# Altium project Linux-Capable-Business-Card.PrjPcb
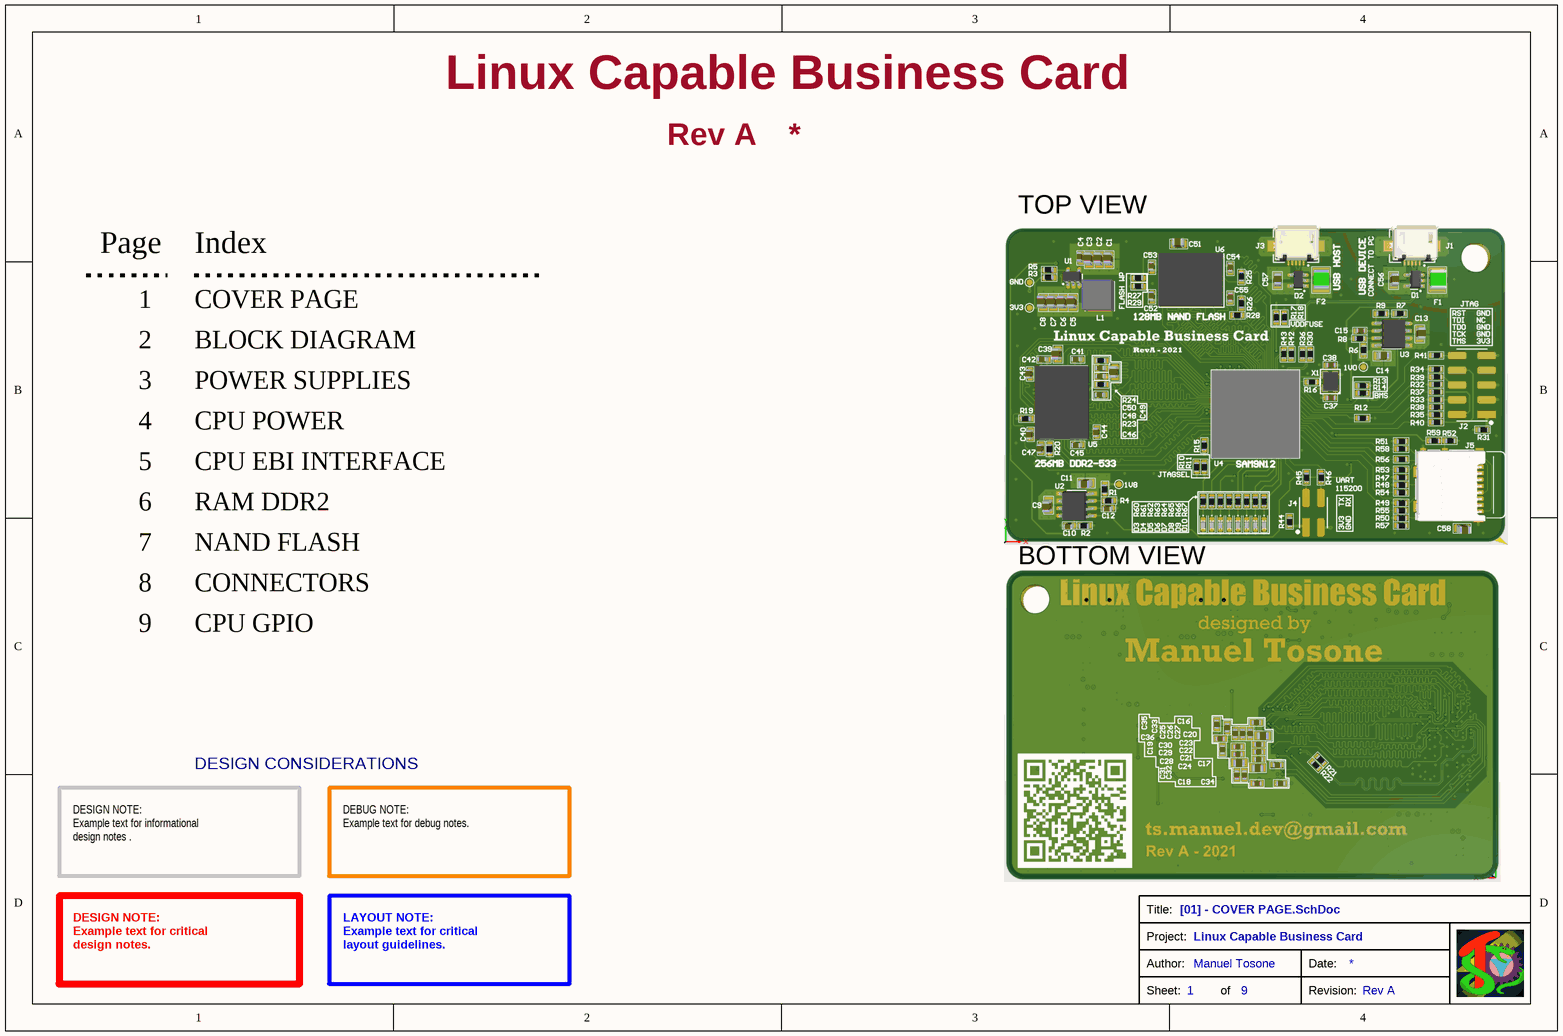
[diagram p0: [01] - COVER PAGE.SchDoc]
AuthorName: Manuel Tosone; ProjectRevision: Rev A; ProjectTitle: Linux Capable Business Card
9 sheets, 154 parts. Net scope: flat (ports and power ports of the same name join across sheets).
Board file: Linux-Capable-Businnes-Card.PcbDoc
Sheets:
  [01] - COVER PAGE.SchDoc
  [02] - BLOCK DIAGRAM.SchDoc
  [03] - POWER SUPPLIES.SchDoc
  [04] - CPU POWER.SchDoc
  [05] - CPU EBI INTERFACE.SchDoc
  [06] - RAM DDR2.SchDoc
  [07] - NAND FLASH.SchDoc
  [08] - CONNECTORS.SchDoc
  [09] - CPU GPIO.SchDoc

## Sheet [01] - COVER PAGE.SchDoc
size A4; DocumentNumber: 1; SheetNumber: 1; SheetTotal: 9

### Notes on the sheet
- TOP VIEW
- Page
- 1
- Index
- COVER PAGE
- 2
- BLOCK DIAGRAM
- 3
- 4
- POWER SUPPLIES
- CPU POWER
- 5
- 6
- CPU EBI INTERFACE
- RAM DDR2
- 7
- NAND FLASH
- BOTTOM VIEW
- 8
- 9
- CONNECTORS
- CPU GPIO
- DESIGN CONSIDERATIONS
- DESIGN NOTE:
  Example text for informational
  design notes .
- DEBUG NOTE:
  Example text for debug notes.
- DESIGN NOTE:
  Example text for critical
  design notes.
- LAYOUT NOTE:
  Example text for critical
  layout guidelines.
- Title:
- Project:
- Sheet:
- Author:
- of
- Revision:
- Date:

## Sheet [02] - BLOCK DIAGRAM.SchDoc
size A4; DocumentNumber: 2; SheetNumber: 2; SheetTotal: 9
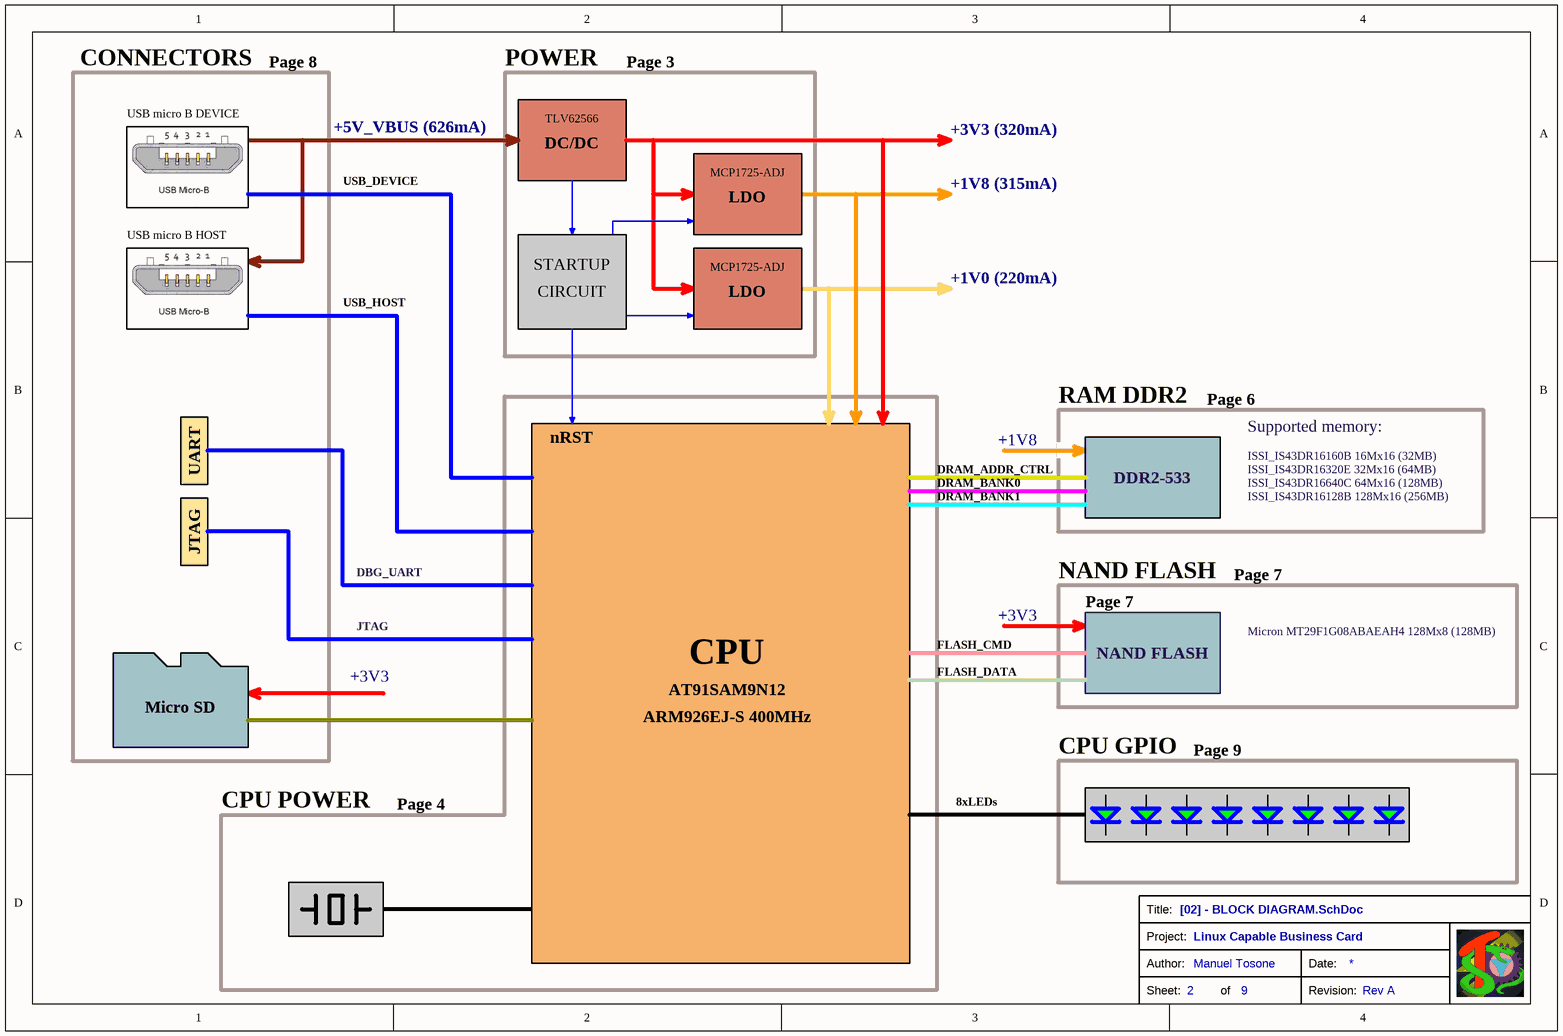
[diagram p1: [02] - BLOCK DIAGRAM.SchDoc]

### Notes on the sheet
- CONNECTORS
- USB micro B DEVICE
- Page 8
- POWER
- Page 3
- USB_DEVICE
- +5V_VBUS (626mA)
- TLV62566
- DC/DC
- MCP1725-ADJ
- +3V3 (320mA)
- USB micro B HOST
- LDO
- +1V8 (315mA)
- USB_HOST
- STARTUP
- CIRCUIT
- +1V0 (220mA)
- UART
- nRST
- +1V8
- PMIC 1
- RAM DDR2
- Page 6
- Supported memory:
- DRAM_ADDR_CTRL
- DRAM_BANK0
- DRAM_BANK1
- DDR2-533
- ISSI_IS43DR16160B 16Mx16 (32MB)
- ISSI_IS43DR16320E 32Mx16 (64MB)
- ISSI_IS43DR16640C 64Mx16 (128MB)
- ISSI_IS43DR16128B 128Mx16 (256MB)
- JTAG
- DBG_UART
- NAND FLASH
- Page 7
- FLASH_CMD
- +3V3
- Micron MT29F1G08ABAEAH4 128Mx8 (128MB)
- Micro SD
- AT91SAM9N12
- CPU
- FLASH_DATA
- ARM926EJ-S 400MHz
- CPU GPIO
- Page 9
- CPU POWER
- Page 4
- 8xLEDs
- Title:
- Project:
- Sheet:
- Author:
- of
- Revision:
- Date:

## Sheet [03] - POWER SUPPLIES.SchDoc
size A4; DocumentNumber: 3; SheetNumber: 3; SheetTotal: 9
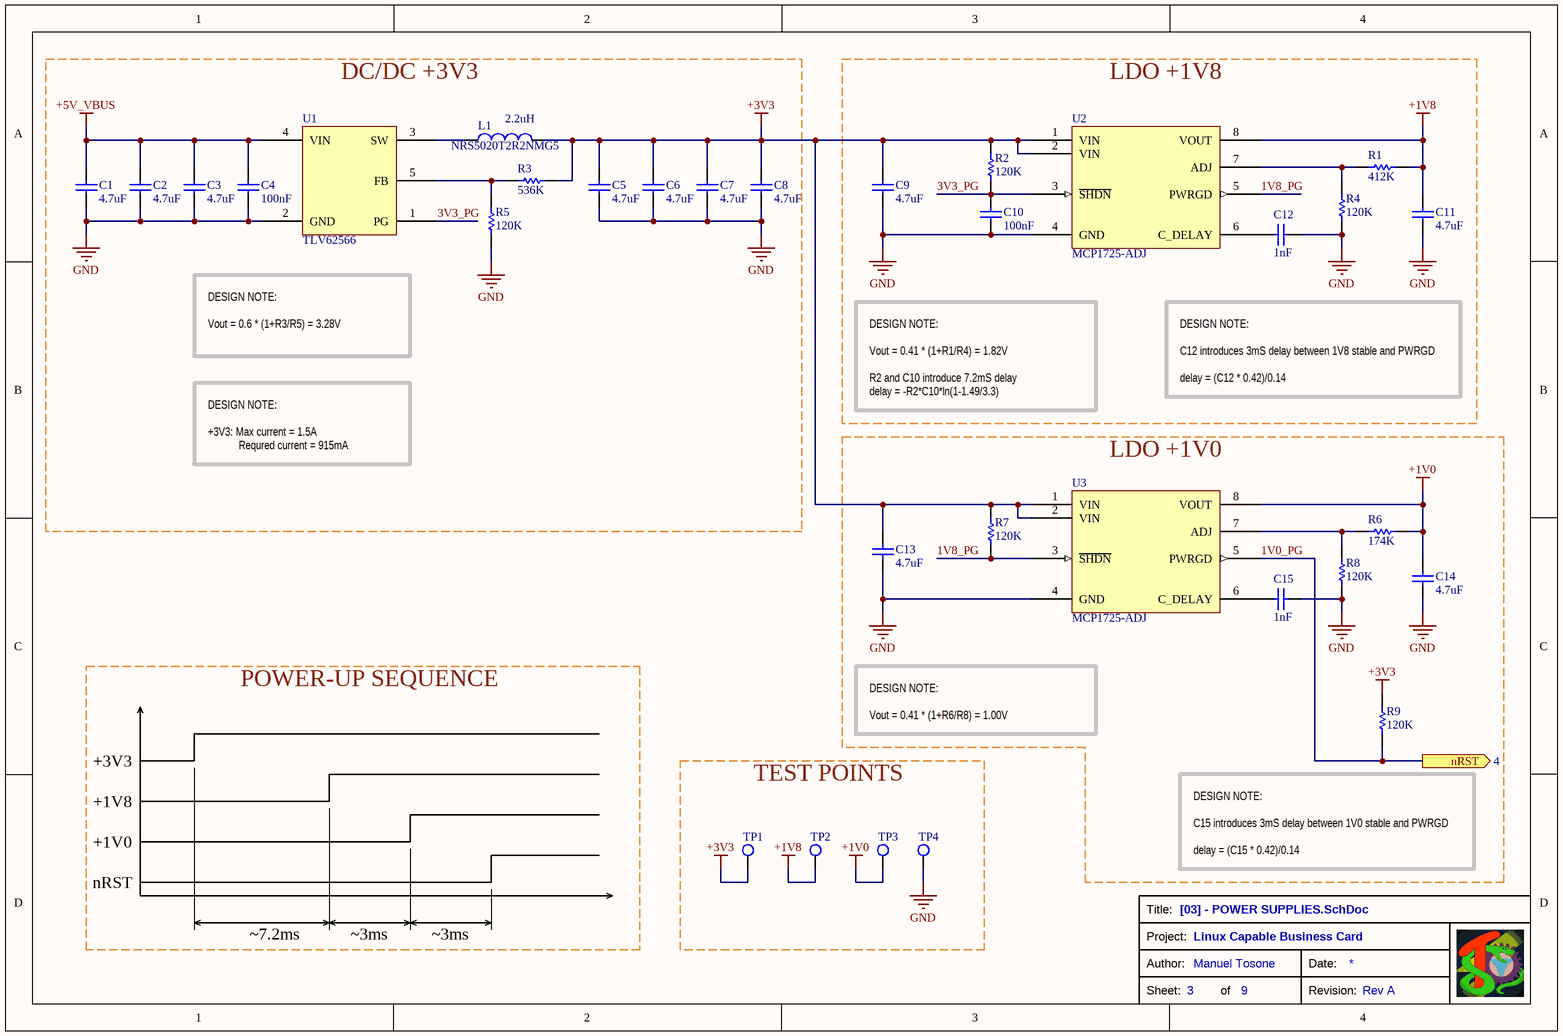
[diagram p2: [03] - POWER SUPPLIES.SchDoc]

### Parts
C1  value 4.7uF  [CAP-0805]  (hidden comment: 885012107013)
C2  value 4.7uF  [CAP-0805]  (hidden comment: 885012107013)
C3  value 4.7uF  [CAP-0805]  (hidden comment: 885012107013)
C4  value 100nF  [CAP-0603]  (hidden comment: C0603C104M4RAC)
C5  value 4.7uF  [CAP-0805]  (hidden comment: 885012107013)
C6  value 4.7uF  [CAP-0805]  (hidden comment: 885012107013)
C7  value 4.7uF  [CAP-0805]  (hidden comment: 885012107013)
C8  value 4.7uF  [CAP-0805]  (hidden comment: 885012107013)
C9  value 4.7uF  [CAP-0805]  (hidden comment: 885012107013)
C10  value 100nF  [CAP-0603]  (hidden comment: C0603C104M4RAC)
C11  value 4.7uF  [CAP-0805]  (hidden comment: 885012107013)
C12  value 1nF  [CAP-0603]  (hidden comment: C0603C102J5RACTU)
C13  value 4.7uF  [CAP-0805]  (hidden comment: 885012107013)
C14  value 4.7uF  [CAP-0805]  (hidden comment: 885012107013)
C15  value 1nF  [CAP-0603]  (hidden comment: C0603C102J5RACTU)
L1  NRS5020T2R2NMG5  value 2.2uH  [NRS5020-SMT-INDUCTOR]
R1  value 412K  [RES-0603]  (hidden comment: RT0603FRE07412KL)
R2  value 120K  [RES-0603]  (hidden comment: RT0603FRE07120KL)
R3  value 536K  [RES-0603]  (hidden comment: RT0603FRE07536KL)
R4  value 120K  [RES-0603]  (hidden comment: RT0603FRE07120KL)
R5  value 120K  [RES-0603]  (hidden comment: RT0603FRE07120KL)
R6  value 174K  [RES-0603]  (hidden comment: RT0603FRE07174KL)
R7  value 120K  [RES-0603]  (hidden comment: RT0603FRE07120KL)
R8  value 120K  [RES-0603]  (hidden comment: RT0603FRE07120KL)
R9  value 120K  [RES-0603]  (hidden comment: RT0603FRE07120KL)
TP1  Test Point 1mm  [TESTPOINT-1mm]  (value not drawn)  (no BOM)
TP2  Test Point 1mm  [TESTPOINT-1mm]  (value not drawn)  (no BOM)
TP3  Test Point 1mm  [TESTPOINT-1mm]  (value not drawn)  (no BOM)
TP4  Test Point 1mm  [TESTPOINT-1mm]  (value not drawn)  (no BOM)
U1  TLV62566  [SOT23-5]
U2  MCP1725-ADJ  [SOIC-8_3.9X4.9]
U3  MCP1725-ADJ  [SOIC-8_3.9X4.9]

### Blocks framed on the sheet
DC/DC +3V3: C1-C8 L1 R3 R5 U1
LDO +1V8: C9-C12 R1 R2 R4 U2
LDO +1V0: C13-C15 R6-R9 U3
TEST POINTS: TP1-TP4

### Ports
nRST (out, see 4)

### Nets
+1V0: C14.2 R6.2 TP3.1 U3.8(VOUT)
+1V8: C11.2 R1.2 TP2.1 U2.8(VOUT)
+3V3: C5.2 C6.2 C7.2 C8.2 C9.2 C13.2 L1.2 R2.2 R3.1 R7.2 R9.2 TP1.1 U2.1(VIN) U2.2(VIN) U3.1(VIN) U3.2(VIN)
+5V_VBUS: C1.2 C2.2 C3.2 C4.2 U1.4(VIN)
GND: C1.1 C2.1 C3.1 C4.1 C5.1 C6.1 C7.1 C8.1 C9.1 C10.1 C11.1 C12.1 C13.1 C14.1 C15.1 R4.1 R5.1 R8.1 TP4.1 U1.2(GND) U2.4(GND) U3.4(GND)
1V0_PG: R9.1 U3.5(PWRGD) ; port nRST
1V8_PG: R7.1 U2.5(PWRGD) U3.3(~{SHDN})
3V3_PG: C10.2 R2.1 U1.1(PG) U2.3(~{SHDN})
NetC12_2: C12.2 U2.6(C_DELAY)
NetC15_2: C15.2 U3.6(C_DELAY)
NetL1_1: L1.1 U1.3(SW)
NetR1_1: R1.1 R4.2 U2.7(ADJ)
NetR3_2: R3.2 R5.2 U1.5(FB)
NetR6_1: R6.1 R8.2 U3.7(ADJ)

### Notes on the sheet
- DESIGN NOTE:
  Vout = 0.6 * (1+R3/R5) = 3.28V
- DESIGN NOTE:
  C12 introduces 3mS delay between 1V8 stable and PWRGD
  delay = (C12 * 0.42)/0.14
- DESIGN NOTE:
  +3V3: Max current = 1.5A
  Requred current = 915mA
- DESIGN NOTE:
  Vout = 0.41 * (1+R1/R4) = 1.82V
  R2 and C10 introduce 7.2mS delay
  delay = -R2*C10*ln(1-1.49/3.3)
- POWER-UP SEQUENCE
- +3V3
- DESIGN NOTE:
  Vout = 0.41 * (1+R6/R8) = 1.00V
- +1V8
- +1V0
- nRST
- ~7.2ms
- ~3ms
- DESIGN NOTE:
  C15 introduces 3mS delay between 1V0 stable and PWRGD
  delay = (C15 * 0.42)/0.14
- Title:
- Project:
- Sheet:
- Author:
- of
- Revision:
- Date:

### Library data of the parts
C1-C3 C5-C9 C11 C13 C14 = CAP-0805-4.7u-885012107013_2: Multilayer Ceramic Capacitors MLCC - SMD/SMT WCAP-CSGP 4.7uF 0805 20% 16V MLCC; Manufacturer: Wurth Elektronik; Voltage Rating DC: 16 VDC; Supplier 1: Mouser; Supplier Part Number 1: 710-885012107013
C4 C10 = CAP-0603-100n-C0603C104M4RAC: Multilayer Ceramic Capacitors MLCC - SMD/SMT 16V 0.1uF X7R 0603 20%; Manufacturer: KEMET; Voltage Rating DC: 16 VDC; Supplier 1: Mouser; Supplier Part Number 1: 80-C0603C104M4RAC
C12 C15 = CAP-0603-1n-C0603C102J5RACTU: Multilayer Ceramic Capacitors MLCC - SMD/SMT 50V 1000pF X7R 0603 5%; Manufacturer: KEMET; Voltage Rating DC: 50 VDC; Supplier 1: Mouser; Supplier Part Number 1: 80-C0603C102J5R
L1 = IND-NRS5020T2R2NMG5: Fixed Inductors 5020 2.2uH 42mOhms +/-30%Tol 2900mA; Supplier 1: Mouser; Supplier Part Number 1: 963-NRS5020T2R2NMGJ
R1 = RES-0603-412K-RT0603FRE07412KL: Thin Film Resistors - SMD 1/10W 412K ohm 1% 50ppm; Manufacturer: Yageo; Supplier 1: Mouser; Supplier Part Number 1: 603-RT0603FRE07412KL
R2 R4 R5 R7-R9 = RES-0603-120K-RT0603FRE07120KL: Thin Film Resistors - SMD 1/10W 120K ohm 1% 50ppm; Manufacturer: Yageo; Supplier 1: Mouser; Supplier Part Number 1: 603-RT0603FRE07120KL
R3 = RES-0603-536K-RT0603FRE07536KL: Thin Film Resistors - SMD 1/10W 536K ohm 1% 50ppm; Manufacturer: Yageo; Supplier 1: Mouser; Supplier Part Number 1: 603-RT0603FRE07536KL
R6 = RES-0603-174K-RT0603FRE07174KL: Thin Film Resistors - SMD 1/10W 174K ohm 1% 50ppm; Manufacturer: Yageo; Supplier 1: Mouser; Supplier Part Number 1: 603-RT0603FRE07174KL
TP1-TP4 = TESTPOINT-1mm: Value: Value
U1 = TLV62566: TLV6256x 1.5-A High Efficiency Step-Down Converters in SOT-23 5-Pin Package; Supplier 1: Mouser; Supplier Part Number 1: 595-TLV62566DBVR
U2 U3 = MCP1725-ADJ: 500 mA, Low Voltage, Low Quiescent Current LDO Regulator; Supplier 1: Mouser; Supplier Part Number 1: 579-MCP1725-ADJE/SN

## Sheet [04] - CPU POWER.SchDoc
size A4; DocumentNumber: 4; SheetNumber: 4; SheetTotal: 9
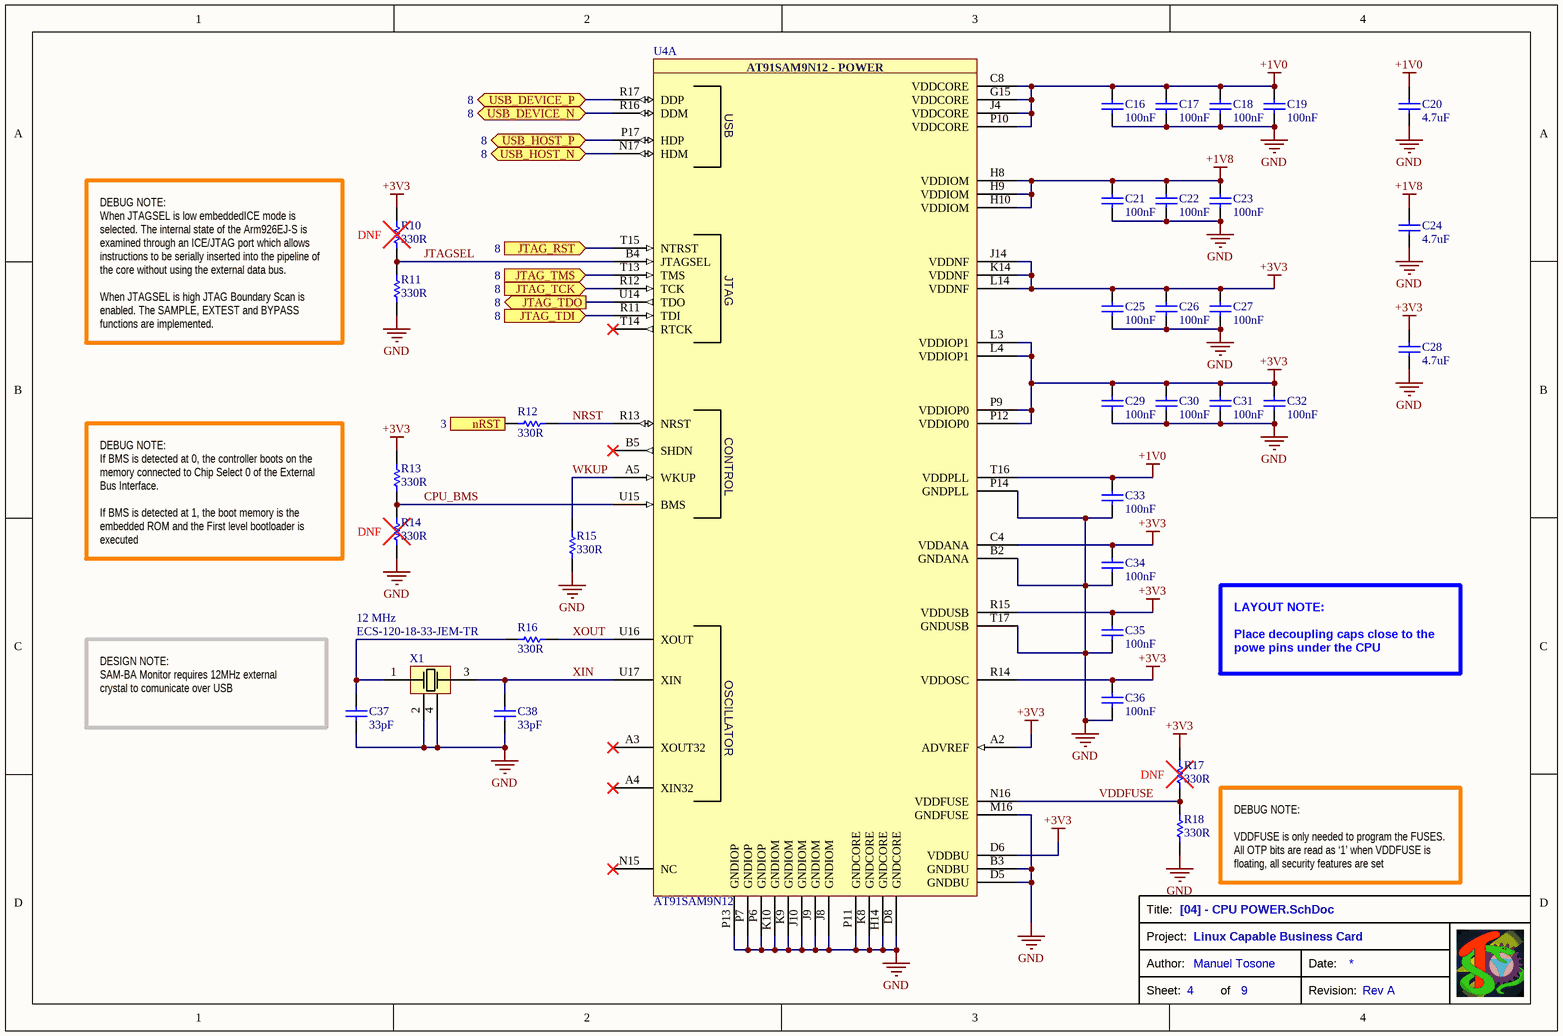
[diagram p3: [04] - CPU POWER.SchDoc]

### Parts
C16  value 100nF  [CAP-0603]  (hidden comment: C0603C104M4RAC)
C17  value 100nF  [CAP-0603]  (hidden comment: C0603C104M4RAC)
C18  value 100nF  [CAP-0603]  (hidden comment: C0603C104M4RAC)
C19  value 100nF  [CAP-0603]  (hidden comment: C0603C104M4RAC)
C20  value 4.7uF  [CAP-0805]  (hidden comment: 885012107013)
C21  value 100nF  [CAP-0603]  (hidden comment: C0603C104M4RAC)
C22  value 100nF  [CAP-0603]  (hidden comment: C0603C104M4RAC)
C23  value 100nF  [CAP-0603]  (hidden comment: C0603C104M4RAC)
C24  value 4.7uF  [CAP-0805]  (hidden comment: 885012107013)
C25  value 100nF  [CAP-0603]  (hidden comment: C0603C104M4RAC)
C26  value 100nF  [CAP-0603]  (hidden comment: C0603C104M4RAC)
C27  value 100nF  [CAP-0603]  (hidden comment: C0603C104M4RAC)
C28  value 4.7uF  [CAP-0805]  (hidden comment: 885012107013)
C29  value 100nF  [CAP-0603]  (hidden comment: C0603C104M4RAC)
C30  value 100nF  [CAP-0603]  (hidden comment: C0603C104M4RAC)
C31  value 100nF  [CAP-0603]  (hidden comment: C0603C104M4RAC)
C32  value 100nF  [CAP-0603]  (hidden comment: C0603C104M4RAC)
C33  value 100nF  [CAP-0603]  (hidden comment: C0603C104M4RAC)
C34  value 100nF  [CAP-0603]  (hidden comment: C0603C104M4RAC)
C35  value 100nF  [CAP-0603]  (hidden comment: C0603C104M4RAC)
C36  value 100nF  [CAP-0603]  (hidden comment: C0603C104M4RAC)
C37  value 33pF  [CAP-0603]  (hidden comment: 885012006054)
C38  value 33pF  [CAP-0603]  (hidden comment: 885012006054)
R10  value 330R  [RES-0603]  (hidden comment: RT0603FRD07330RL)
R11  value 330R  [RES-0603]  (hidden comment: RT0603FRD07330RL)
R12  value 330R  [RES-0603]  (hidden comment: RT0603FRD07330RL)
R13  value 330R  [RES-0603]  (hidden comment: RT0603FRD07330RL)
R14  value 330R  [RES-0603]  (hidden comment: RT0603FRD07330RL)
R15  value 330R  [RES-0603]  (hidden comment: RT0603FRD07330RL)
R16  value 330R  [RES-0603]  (hidden comment: RT0603FRD07330RL)
R17  value 330R  [RES-0603]  (hidden comment: RT0603FRD07330RL)
R18  value 330R  [RES-0603]  (hidden comment: RT0603FRD07330RL)
U4  AT91SAM9N12  [BGA0.8P17X17_217_15X15]  (part A of 6)
X1  ECS-120-18-33-JEM-TR  value 12 MHz  [XTAL-ECX32-3.2X2.5]

### Ports
JTAG_RST (in, see 8), JTAG_TCK (in, see 8), JTAG_TDI (in, see 8), JTAG_TDO (out, see 8), JTAG_TMS (in, see 8), nRST (in, see 3), USB_DEVICE_N (bidir, see 8), USB_DEVICE_P (bidir, see 8), USB_HOST_N (bidir, see 8), USB_HOST_P (bidir, see 8)

### Nets
+1V0: C16.2 C17.2 C18.2 C19.2 C20.2 C33.2 U4.C8(VDDCORE) U4.G15(VDDCORE) U4.J4(VDDCORE) U4.P10(VDDCORE) U4.T16(VDDPLL)
+1V8: C21.2 C22.2 C23.2 C24.2 U4.H8(VDDIOM) U4.H9(VDDIOM) U4.H10(VDDIOM)
+3V3: C25.2 C26.2 C27.2 C28.2 C29.2 C30.2 C31.2 C32.2 C34.2 C35.2 C36.2 R10.2 R13.2 R17.2 U4.A2(ADVREF) U4.C4(VDDANA) U4.D6(VDDBU) U4.J14(VDDNF) U4.K14(VDDNF) U4.L3(VDDIOP1) U4.L4(VDDIOP1) U4.L14(VDDNF) U4.P9(VDDIOP0) U4.P12(VDDIOP0) U4.R14(VDDOSC) U4.R15(VDDUSB)
GND: C16.1 C17.1 C18.1 C19.1 C20.1 C21.1 C22.1 C23.1 C24.1 C25.1 C26.1 C27.1 C28.1 C29.1 C30.1 C31.1 C32.1 C33.1 C34.1 C35.1 C36.1 C37.1 C38.1 R11.1 R14.1 R15.1 R18.1 U4.B2(GNDANA) U4.B3(GNDBU) U4.D5(GNDBU) U4.D8(GNDCORE) U4.H14(GNDCORE) U4.J8(GNDIOM) U4.J9(GNDIOM) U4.J10(GNDIOM) U4.K8(GNDCORE) U4.K9(GNDIOM) U4.K10(GNDIOM) U4.M16(GNDFUSE) U4.P6(GNDIOP) U4.P7(GNDIOP) U4.P11(GNDCORE) U4.P13(GNDIOP) U4.P14(GNDPLL) U4.T17(GNDUSB) X1.2 X1.4
1V0_PG: R12.1 ; port nRST
CPU_BMS: R13.1 R14.2 U4.U15(BMS)
JTAG_TCK: U4.R12(TCK) ; port JTAG_TCK
JTAG_TDI: U4.R11(TDI) ; port JTAG_TDI
JTAG_TDO: U4.U14(TDO) ; port JTAG_TDO
JTAG_TMS: U4.T13(TMS) ; port JTAG_TMS
JTAGSEL: R10.1 R11.2 U4.B4(JTAGSEL)
NRST: R12.2 U4.R13(NRST)
NTRST: U4.T15(NTRST) ; port JTAG_RST
USBD_N: U4.R16(DDM) ; port USB_DEVICE_N
USBD_P: U4.R17(DDP) ; port USB_DEVICE_P
USBH_N: U4.N17(HDM) ; port USB_HOST_N
USBH_P: U4.P17(HDP) ; port USB_HOST_P
VDDFUSE: R17.1 R18.2 U4.N16(VDDFUSE)
WKUP: R15.2 U4.A5(WKUP)
XIN: C38.2 U4.U17(XIN) X1.3
XOUT: R16.2 U4.U16(XOUT)
NetC37_2: C37.2 R16.1 X1.1

Not connected (* = marked no-connect by the designer): U4 A3(XOUT32)* A4(XIN32)* B5(SHDN)* N15(NC)* T14(RTCK)*

### Notes on the sheet
- (near R10) DNF
- DEBUG NOTE:
  When JTAGSEL is low embeddedICE mode is selected. The internal state of the Arm926EJ-S is examined through an ICE/JTAG port which allows instructions to be serially inserted into the pipeline of the core without using the external data bus.
  When JTAGSEL is high JTAG Boundary Scan is enabled. The SAMPLE, EXTEST and BYPASS functions are implemented.
- DEBUG NOTE:
  If BMS is detected at 0, the controller boots on the memory connected to Chip Select 0 of the External Bus Interface.
  If BMS is detected at 1, the boot memory is the embedded ROM and the First level bootloader is executed
- (near R14) DNF
- DESIGN NOTE:
  SAM-BA Monitor requires 12MHz external crystal to comunicate over USB
- LAYOUT NOTE:
  Place decoupling caps close to the powe pins under the CPU
- (near R17) DNF
- DEBUG NOTE:
  VDDFUSE is only needed to program the FUSES. All OTP bits are read as ‘1’ when VDDFUSE is floating, all security features are set
- Title:
- Project:
- Sheet:
- Author:
- of
- Revision:
- Date:
- (in symbol AT91SAM9N12, part A) AT91SAM9N12 - POWER; USB; JTAG; CONTROL; OSCILLATOR

### Library data of the parts
C16-C19 C21-C23 C25-C27 C29-C36 = CAP-0603-100n-C0603C104M4RAC: as C4 on sheet [03] - POWER SUPPLIES; Supplier 1: Mouser; Supplier Part Number 1: 80-C0603C104M4RAC
C20 C24 C28 = CAP-0805-4.7u-885012107013_2: as C1 on sheet [03] - POWER SUPPLIES; Supplier 1: Mouser; Supplier Part Number 1: 710-885012107013
C37 C38 = CAP-0603-33p-885012006054: Multilayer Ceramic Capacitors MLCC - SMD/SMT WCAP-CSGP 33pF 0603 5% 50V MLCC; Manufacturer: Wurth Elektronik; Voltage Rating DC: 50 VDC; Supplier 1: Mouser; Supplier Part Number 1: 710-885012006054
R10-R18 = RES-0603-330R-RT0603FRD07330RL: Thin Film Resistors - SMD 1/10W 330 ohm 1% 50ppm; Manufacturer: Yageo; Supplier 1: Mouser; Supplier Part Number 1: 603-RT0603FRD07330RL
U4 = AT91SAM9N12: MPU ARM926EJ-S 400MHz; Supplier 1: Mouser; Supplier Part Number 1: 556-AT91SAM9N12-CU
X1 = XTAL-12MHz-ECS-120-18-33-JEM-TR: Crystals 12MHz 20ppm 18pF -20C +70C; Supplier 1: Mouser; Supplier Part Number 1: 520-120-18-33-JEMT; Shunt Capacitance: 18 pF

## Sheet [05] - CPU EBI INTERFACE.SchDoc
size A4; DocumentNumber: 5; SheetNumber: 5; SheetTotal: 9
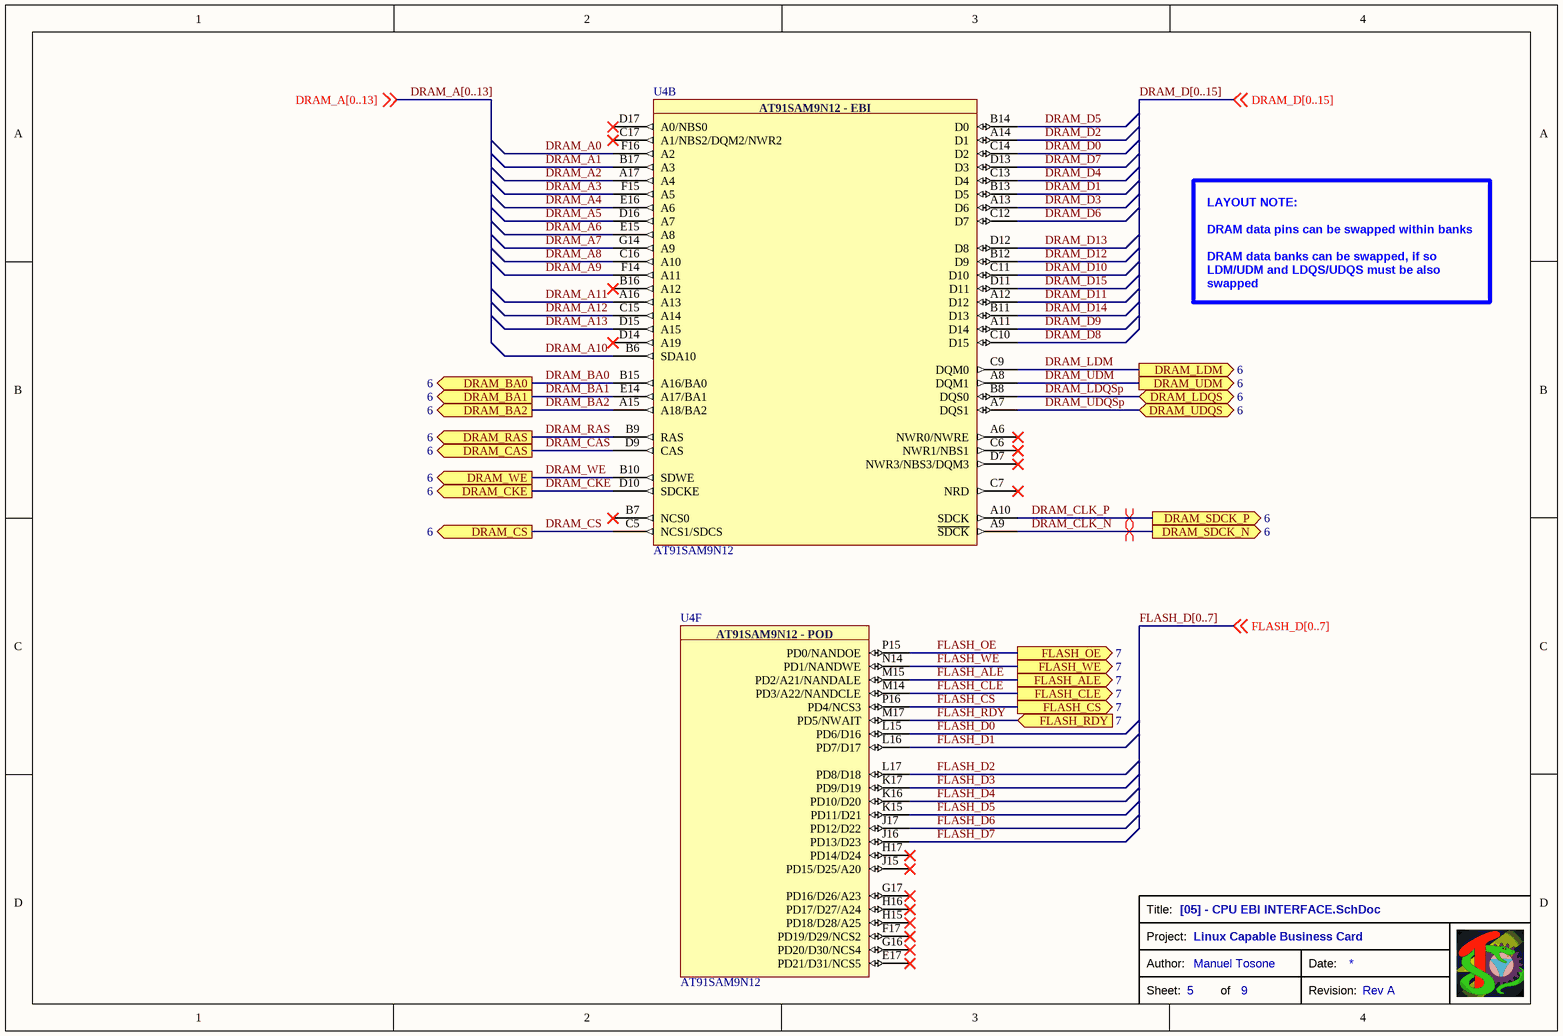
[diagram p4: [05] - CPU EBI INTERFACE.SchDoc]

### Parts
U4  AT91SAM9N12  [BGA0.8P17X17_217_15X15]  (parts B,F of 6)

### Ports
DRAM_BA0 (out, see 6), DRAM_BA1 (out, see 6), DRAM_BA2 (out, see 6), DRAM_CAS (out, see 6), DRAM_CKE (out, see 6), DRAM_CS (out, see 6), DRAM_LDM (out, see 6), DRAM_LDQS (bidir, see 6), DRAM_RAS (out, see 6), DRAM_SDCK_N (out, see 6), DRAM_SDCK_P (out, see 6), DRAM_UDM (out, see 6), DRAM_UDQS (bidir, see 6), DRAM_WE (out, see 6), FLASH_ALE (out, see 7), FLASH_CLE (out, see 7), FLASH_CS (out, see 7), FLASH_OE (out, see 7), FLASH_RDY (in, see 7), FLASH_WE (out, see 7)

### Nets
DRAM_A0: U4.F16(A2)
DRAM_A1: U4.B17(A3)
DRAM_A2: U4.A17(A4)
DRAM_A3: U4.F15(A5)
DRAM_A4: U4.E16(A6)
DRAM_A5: U4.D16(A7)
DRAM_A6: U4.E15(A8)
DRAM_A7: U4.G14(A9)
DRAM_A8: U4.C16(A10)
DRAM_A9: U4.F14(A11)
DRAM_A10: U4.B6(SDA10)
DRAM_A11: U4.A16(A13)
DRAM_A12: U4.C15(A14)
DRAM_A13: U4.D15(A15)
DRAM_BA0: U4.B15(A16/BA0) ; port DRAM_BA0
DRAM_BA1: U4.E14(A17/BA1) ; port DRAM_BA1
DRAM_BA2: U4.A15(A18/BA2) ; port DRAM_BA2
DRAM_CAS: U4.D9(CAS) ; port DRAM_CAS
DRAM_CKE: U4.D10(SDCKE) ; port DRAM_CKE
DRAM_CLK_N: U4.A9(~{SDCK}) ; port DRAM_SDCK_N
DRAM_CLK_P: U4.A10(SDCK) ; port DRAM_SDCK_P
DRAM_CS: U4.C5(NCS1/SDCS) ; port DRAM_CS
DRAM_D0: U4.C14(D2)
DRAM_D1: U4.B13(D5)
DRAM_D2: U4.A14(D1)
DRAM_D3: U4.A13(D6)
DRAM_D4: U4.C13(D4)
DRAM_D5: U4.B14(D0)
DRAM_D6: U4.C12(D7)
DRAM_D7: U4.D13(D3)
DRAM_D8: U4.C10(D15)
DRAM_D9: U4.A11(D14)
DRAM_D10: U4.C11(D10)
DRAM_D11: U4.A12(D12)
DRAM_D12: U4.B12(D9)
DRAM_D13: U4.D12(D8)
DRAM_D14: U4.B11(D13)
DRAM_D15: U4.D11
DRAM_LDM: U4.C9(DQM0) ; port DRAM_LDM
DRAM_LDQSp: U4.B8(DQS0) ; port DRAM_LDQS
DRAM_RAS: U4.B9(RAS) ; port DRAM_RAS
DRAM_UDM: U4.A8(DQM1) ; port DRAM_UDM
DRAM_UDQSp: U4.A7(DQS1) ; port DRAM_UDQS
DRAM_WE: U4.B10(SDWE) ; port DRAM_WE
FLASH_ALE: U4.M15(PD2/A21/NANDALE) ; port FLASH_ALE
FLASH_CLE: U4.M14(PD3/A22/NANDCLE) ; port FLASH_CLE
FLASH_CS: U4.P16(PD4/NCS3) ; port FLASH_CS
FLASH_D0: U4.L15(PD6/D16)
FLASH_D1: U4.L16(PD7/D17)
FLASH_D2: U4.L17(PD8/D18)
FLASH_D3: U4.K17(PD9/D19)
FLASH_D4: U4.K16(PD10/D20)
FLASH_D5: U4.K15(PD11/D21)
FLASH_D6: U4.J17(PD12/D22)
FLASH_D7: U4.J16(PD13/D23)
FLASH_OE: U4.P15(PD0/NANDOE) ; port FLASH_OE
FLASH_RDY: U4.M17(PD5/NWAIT) ; port FLASH_RDY
FLASH_WE: U4.N14(PD1/NANDWE) ; port FLASH_WE

Not connected (* = marked no-connect by the designer): U4 A6(NWR0/NWRE)* B7(NCS0)* B16(A12)* C6(NWR1/NBS1)* C7(NRD)* C17(A1/NBS2/DQM2/NWR2)* D7(NWR3/NBS3/DQM3)* D14(A19)* D17(A0/NBS0)* E17(PD21/D31/NCS5)* F17(PD19/D29/NCS2)* G16(PD20/D30/NCS4)* G17(PD16/D26/A23)* H15(PD18/D28/A25)* H16(PD17/D27/A24)* H17(PD14/D24)* J15(PD15/D25/A20)*

### Buses and harness runs
bus DRAM_A[0..13]
bus DRAM_D[0..15]
bus FLASH_D[0..7]

### Layout directives
differential pair; differential pair class DIFF100: DRAM_CLK_N, DRAM_CLK_P

### Notes on the sheet
- LAYOUT NOTE:
  DRAM data pins can be swapped within banks
  DRAM data banks can be swapped, if so LDM/UDM and LDQS/UDQS must be also swapped
- Title:
- Project:
- Sheet:
- Author:
- of
- Revision:
- Date:
- (in symbol AT91SAM9N12, part B) AT91SAM9N12 - EBI
- (in symbol AT91SAM9N12, part F) AT91SAM9N12 - POD

### Library data of the parts
U4 = AT91SAM9N12: MPU ARM926EJ-S 400MHz; Supplier 1: Mouser; Supplier Part Number 1: 556-AT91SAM9N12-CU

## Sheet [06] - RAM DDR2.SchDoc
size A4; DocumentNumber: 6; SheetNumber: 6; SheetTotal: 9
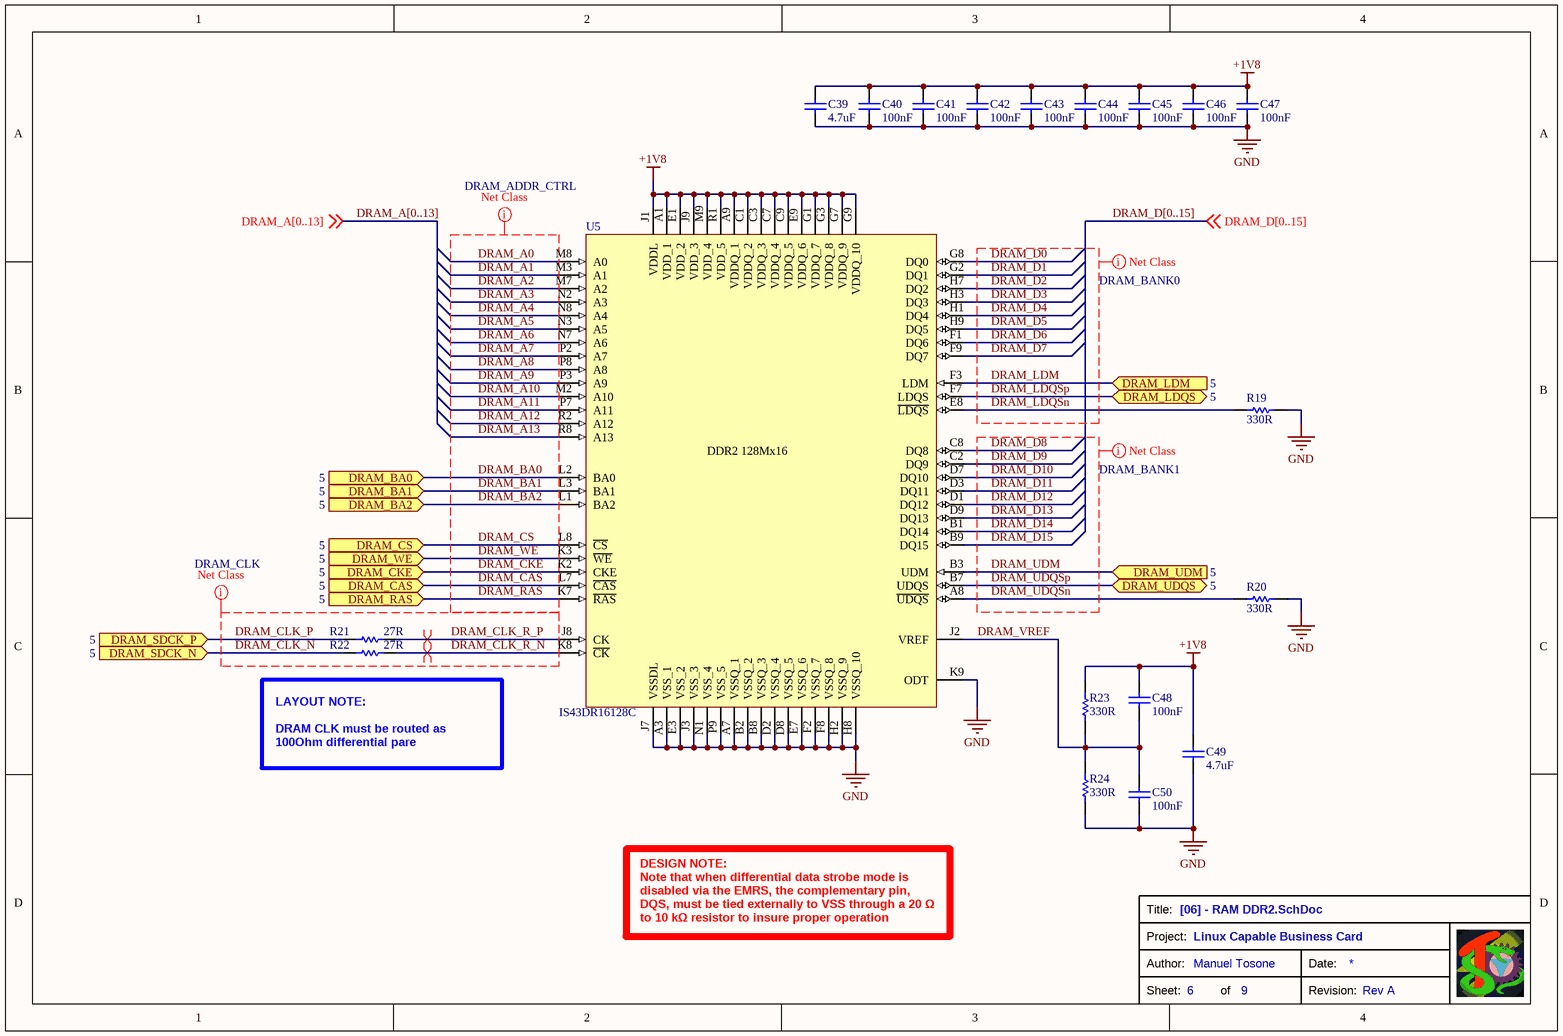
[diagram p5: [06] - RAM DDR2.SchDoc]

### Parts
C39  value 4.7uF  [CAP-0805]  (hidden comment: 885012107013)
C40  value 100nF  [CAP-0603]  (hidden comment: C0603C104M4RAC)
C41  value 100nF  [CAP-0603]  (hidden comment: C0603C104M4RAC)
C42  value 100nF  [CAP-0603]  (hidden comment: C0603C104M4RAC)
C43  value 100nF  [CAP-0603]  (hidden comment: C0603C104M4RAC)
C44  value 100nF  [CAP-0603]  (hidden comment: C0603C104M4RAC)
C45  value 100nF  [CAP-0603]  (hidden comment: C0603C104M4RAC)
C46  value 100nF  [CAP-0603]  (hidden comment: C0603C104M4RAC)
C47  value 100nF  [CAP-0603]  (hidden comment: C0603C104M4RAC)
C48  value 100nF  [CAP-0603]  (hidden comment: C0603C104M4RAC)
C49  value 4.7uF  [CAP-0805]  (hidden comment: 885012107013)
C50  value 100nF  [CAP-0603]  (hidden comment: C0603C104M4RAC)
R19  value 330R  [RES-0603]  (hidden comment: RT0603FRD07330RL)
R20  value 330R  [RES-0603]  (hidden comment: RT0603FRD07330RL)
R21  value 27R  [RES-0603]  (hidden comment: RT0603DRD0727RL)
R22  value 27R  [RES-0603]  (hidden comment: RT0603DRD0727RL)
R23  value 330R  [RES-0603]  (hidden comment: RT0603FRD07330RL)
R24  value 330R  [RES-0603]  (hidden comment: RT0603FRD07330RL)
U5  IS43DR16128C  [BGA0.8_DDR2_86_9X12.5]

### Ports
DRAM_BA0 (in, see 5), DRAM_BA1 (in, see 5), DRAM_BA2 (in, see 5), DRAM_CAS (in, see 5), DRAM_CKE (in, see 5), DRAM_CS (in, see 5), DRAM_LDM (in, see 5), DRAM_LDQS (bidir, see 5), DRAM_RAS (in, see 5), DRAM_SDCK_N (in, see 5), DRAM_SDCK_P (in, see 5), DRAM_UDM (in, see 5), DRAM_UDQS (bidir, see 5), DRAM_WE (in, see 5)

### Nets
+1V8: C39.2 C40.2 C41.2 C42.2 C43.2 C44.2 C45.2 C46.2 C47.2 C48.2 C49.2 R23.2 U5.A1(VDD_1) U5.A9(VDDQ_1) U5.C1(VDDQ_2) U5.C3(VDDQ_3) U5.C7(VDDQ_4) U5.C9(VDDQ_5) U5.E1(VDD_2) U5.E9(VDDQ_6) U5.G1(VDDQ_7) U5.G3(VDDQ_8) U5.G7(VDDQ_9) U5.G9(VDDQ_10) U5.J1(VDDL) U5.J9(VDD_3) U5.M9(VDD_4) U5.R1(VDD_5)
GND: C39.1 C40.1 C41.1 C42.1 C43.1 C44.1 C45.1 C46.1 C47.1 C49.1 C50.1 R19.1 R20.1 R24.1 U5.A3(VSS_1) U5.A7(VSSQ_1) U5.B2(VSSQ_2) U5.B8(VSSQ_3) U5.D2(VSSQ_4) U5.D8(VSSQ_5) U5.E3(VSS_2) U5.E7(VSSQ_6) U5.F2(VSSQ_7) U5.F8(VSSQ_8) U5.H2(VSSQ_9) U5.H8(VSSQ_10) U5.J3(VSS_3) U5.J7(VSSDL) U5.K9(ODT) U5.N1(VSS_4) U5.P9(VSS_5)
DRAM_A0: U5.M8(A0)
DRAM_A1: U5.M3(A1)
DRAM_A2: U5.M7(A2)
DRAM_A3: U5.N2(A3)
DRAM_A4: U5.N8(A4)
DRAM_A5: U5.N3(A5)
DRAM_A6: U5.N7(A6)
DRAM_A7: U5.P2(A7)
DRAM_A8: U5.P8(A8)
DRAM_A9: U5.P3(A9)
DRAM_A10: U5.M2(A10)
DRAM_A11: U5.P7(A11)
DRAM_A12: U5.R2(A12)
DRAM_A13: U5.R8(A13)
DRAM_BA0: U5.L2(BA0) ; port DRAM_BA0
DRAM_BA1: U5.L3(BA1) ; port DRAM_BA1
DRAM_BA2: U5.L1(BA2) ; port DRAM_BA2
DRAM_CAS: U5.L7(~{CAS}) ; port DRAM_CAS
DRAM_CKE: U5.K2(CKE) ; port DRAM_CKE
DRAM_CLK_N: R22.1 ; port DRAM_SDCK_N
DRAM_CLK_P: R21.1 ; port DRAM_SDCK_P
DRAM_CLK_R_N: R22.2 U5.K8(~{CK})
DRAM_CLK_R_P: R21.2 U5.J8(CK)
DRAM_CS: U5.L8(~{CS}) ; port DRAM_CS
DRAM_D0: U5.G8(DQ0)
DRAM_D1: U5.G2(DQ1)
DRAM_D2: U5.H7(DQ2)
DRAM_D3: U5.H3(DQ3)
DRAM_D4: U5.H1(DQ4)
DRAM_D5: U5.H9(DQ5)
DRAM_D6: U5.F1(DQ6)
DRAM_D7: U5.F9(DQ7)
DRAM_D8: U5.C8(DQ8)
DRAM_D9: U5.C2(DQ9)
DRAM_D10: U5.D7(DQ10)
DRAM_D11: U5.D3(DQ11)
DRAM_D12: U5.D1(DQ12)
DRAM_D13: U5.D9(DQ13)
DRAM_D14: U5.B1(DQ14)
DRAM_D15: U5.B9(DQ15)
DRAM_LDM: U5.F3(LDM) ; port DRAM_LDM
DRAM_LDQSn: R19.2 U5.E8(~{LDQS})
DRAM_LDQSp: U5.F7(LDQS) ; port DRAM_LDQS
DRAM_RAS: U5.K7(~{RAS}) ; port DRAM_RAS
DRAM_UDM: U5.B3(UDM) ; port DRAM_UDM
DRAM_UDQSn: R20.2 U5.A8(~{UDQS})
DRAM_UDQSp: U5.B7(UDQS) ; port DRAM_UDQS
DRAM_VREF: C48.1 C50.2 R23.1 R24.2 U5.J2(VREF)
DRAM_WE: U5.K3(~{WE}) ; port DRAM_WE

### Buses and harness runs
bus DRAM_A[0..13]
bus DRAM_D[0..15]

### Layout directives
net class DRAM_BANK0: DRAM_D0, DRAM_D1, DRAM_D2, DRAM_D3, DRAM_D4, DRAM_D5, DRAM_D6, DRAM_D7, DRAM_LDM, DRAM_LDQSn, DRAM_LDQSp
net class DRAM_BANK1: DRAM_D8, DRAM_D9, DRAM_D10, DRAM_D11, DRAM_D12, DRAM_D13, DRAM_D14, DRAM_D15, DRAM_UDM, DRAM_UDQSn, DRAM_UDQSp
net class DRAM_CLK: DRAM_CLK_N, DRAM_CLK_P, DRAM_CLK_R_N, DRAM_CLK_R_P
net class DRAM_ADDR_CTRL: DRAM_A0, DRAM_A1, DRAM_A2, DRAM_A3, DRAM_A4, DRAM_A5, DRAM_A6, DRAM_A7, DRAM_A8, DRAM_A9, DRAM_A10, DRAM_A11, DRAM_A12, DRAM_A13, DRAM_BA0, DRAM_BA1, DRAM_BA2, DRAM_CAS, DRAM_CKE, DRAM_CS, DRAM_RAS, DRAM_WE
differential pair; differential pair class DIFF100: DRAM_CLK_R_N, DRAM_CLK_R_P

### Notes on the sheet
- LAYOUT NOTE:
  DRAM CLK must be routed as 100Ohm differential pare
- DESIGN NOTE:
  Note that when differential data strobe mode is disabled via the EMRS, the complementary pin, DQS, must be tied externally to VSS through a 20 Ω to 10 kΩ resistor to insure proper operation
- Title:
- Project:
- Sheet:
- Author:
- of
- Revision:
- Date:
- (in symbol ISSI-DDR2-IS43DR16128C) DDR2 128Mx16

### Library data of the parts
C39 C49 = CAP-0805-4.7u-885012107013_2: as C1 on sheet [03] - POWER SUPPLIES; Supplier 1: Mouser; Supplier Part Number 1: 710-885012107013
C40-C48 C50 = CAP-0603-100n-C0603C104M4RAC: as C4 on sheet [03] - POWER SUPPLIES; Supplier 1: Mouser; Supplier Part Number 1: 80-C0603C104M4RAC
R19 R20 R23 R24 = RES-0603-330R-RT0603FRD07330RL: as R10 on sheet [04] - CPU POWER; Supplier 1: Mouser; Supplier Part Number 1: 603-RT0603FRD07330RL
R21 R22 = RES-0603-27R-RT0603DRD0727RL: Thin Film Resistors - SMD 1/10W 27 ohm 1% 50ppm; Manufacturer: Yageo; Supplier 1: Mouser; Supplier Part Number 1: 603-RT0603DRD0727RL
U5 = ISSI-DDR2-IS43DR16128C: 256Mx8, 128Mx16 DDR2 DRAM; Supplier 1: Mouser; Supplier Part Number 1: 870-3DR16128C-25DBLI

## Sheet [07] - NAND FLASH.SchDoc
size A4; DocumentNumber: 7; SheetNumber: 7; SheetTotal: 9
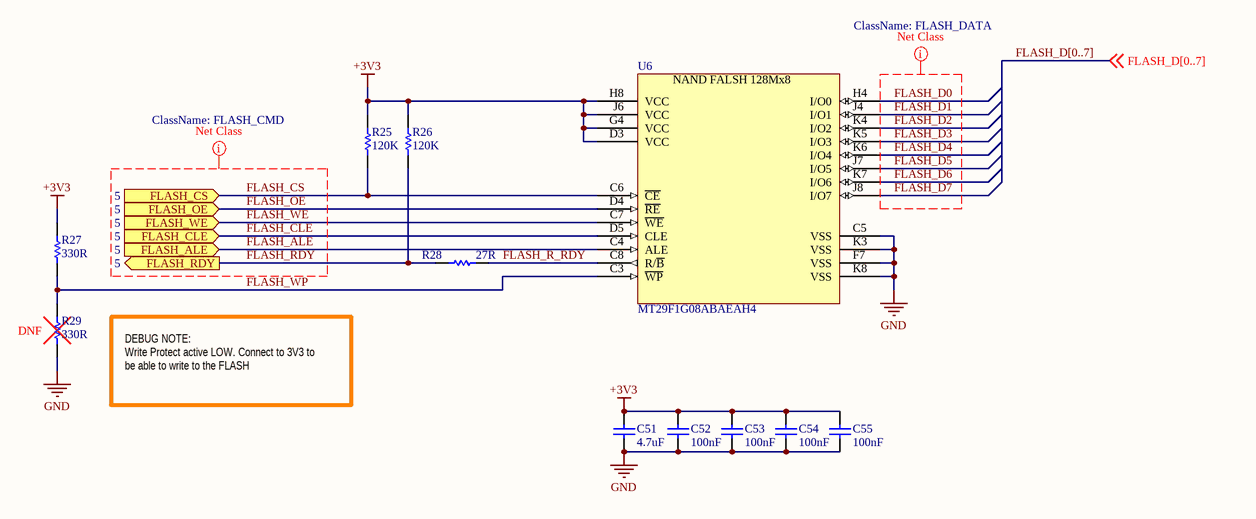
[diagram p6: [07] - NAND FLASH.SchDoc]

### Parts
C51  value 4.7uF  [CAP-0805]  (hidden comment: 885012107013)
C52  value 100nF  [CAP-0603]  (hidden comment: C0603C104M4RAC)
C53  value 100nF  [CAP-0603]  (hidden comment: C0603C104M4RAC)
C54  value 100nF  [CAP-0603]  (hidden comment: C0603C104M4RAC)
C55  value 100nF  [CAP-0603]  (hidden comment: C0603C104M4RAC)
R25  value 120K  [RES-0603]  (hidden comment: RT0603FRE07120KL)
R26  value 120K  [RES-0603]  (hidden comment: RT0603FRE07120KL)
R27  value 330R  [RES-0603]  (hidden comment: RT0603FRD07330RL)
R28  value 27R  [RES-0603]  (hidden comment: RT0603DRD0727RL)
R29  value 330R  [RES-0603]  (hidden comment: RT0603FRD07330RL)
U6  MT29F1G08ABAEAH4  [BGA0.8_FLASH_63_9X11]

### Ports
FLASH_ALE (in, see 5), FLASH_CLE (in, see 5), FLASH_CS (in, see 5), FLASH_OE (in, see 5), FLASH_RDY (out, see 5), FLASH_WE (in, see 5)

### Nets
+3V3: C51.2 C52.2 C53.2 C54.2 C55.2 R25.2 R26.2 R27.2 U6.D3(VCC) U6.G4(VCC) U6.H8(VCC) U6.J6(VCC)
GND: C51.1 C52.1 C53.1 C54.1 C55.1 R29.1 U6.C5(VSS) U6.F7(VSS) U6.K3(VSS) U6.K8(VSS)
FLASH_ALE: U6.C4(ALE) ; port FLASH_ALE
FLASH_CLE: U6.D5(CLE) ; port FLASH_CLE
FLASH_CS: R25.1 U6.C6(~{CE}) ; port FLASH_CS
FLASH_D0: U6.H4(I/O0)
FLASH_D1: U6.J4(I/O1)
FLASH_D2: U6.K4(I/O2)
FLASH_D3: U6.K5(I/O3)
FLASH_D4: U6.K6(I/O4)
FLASH_D5: U6.J7(I/O5)
FLASH_D6: U6.K7(I/O6)
FLASH_D7: U6.J8(I/O7)
FLASH_OE: U6.D4(~{RE}) ; port FLASH_OE
FLASH_R_RDY: R28.2 U6.C8(R/~{B})
FLASH_RDY: R26.1 R28.1 ; port FLASH_RDY
FLASH_WE: U6.C7(~{WE}) ; port FLASH_WE
FLASH_WP: R27.1 R29.2 U6.C3(~{WP})

### Buses and harness runs
bus FLASH_D[0..7]

### Layout directives
net class FLASH_CMD: FLASH_ALE, FLASH_CLE, FLASH_CS, FLASH_OE, FLASH_RDY, FLASH_WE
net class FLASH_DATA: FLASH_D0, FLASH_D1, FLASH_D2, FLASH_D3, FLASH_D4, FLASH_D5, FLASH_D6, FLASH_D7

### Notes on the sheet
- (near R29) DNF
- DEBUG NOTE:
  Write Protect active LOW. Connect to 3V3 to be able to write to the FLASH
- Title:
- Project:
- Sheet:
- Author:
- of
- Revision:
- Date:
- (in symbol MICRON-FLASH-MT29F1G08ABAEAH4) NAND FALSH 128Mx8

### Library data of the parts
C51 = CAP-0805-4.7u-885012107013_2: as C1 on sheet [03] - POWER SUPPLIES; Supplier 1: Mouser; Supplier Part Number 1: 710-885012107013
C52-C55 = CAP-0603-100n-C0603C104M4RAC: as C4 on sheet [03] - POWER SUPPLIES; Supplier 1: Mouser; Supplier Part Number 1: 80-C0603C104M4RAC
R25 R26 = RES-0603-120K-RT0603FRE07120KL: as R2 on sheet [03] - POWER SUPPLIES; Supplier 1: Mouser; Supplier Part Number 1: 603-RT0603FRE07120KL
R27 R29 = RES-0603-330R-RT0603FRD07330RL: as R10 on sheet [04] - CPU POWER; Supplier 1: Mouser; Supplier Part Number 1: 603-RT0603FRD07330RL
R28 = RES-0603-27R-RT0603DRD0727RL: as R21 on sheet [06] - RAM DDR2; Supplier 1: Mouser; Supplier Part Number 1: 603-RT0603DRD0727RL
U6 = MICRON-FLASH-MT29F1G08ABAEAH4: NAND Flash SLC 1G 128MX8 VFBGA-63; Supplier 1: Mouser; Supplier Part Number 1: 340-139663-TRAY

## Sheet [08] - CONNECTORS.SchDoc
size A4; DocumentNumber: 8; SheetNumber: 8; SheetTotal: 9
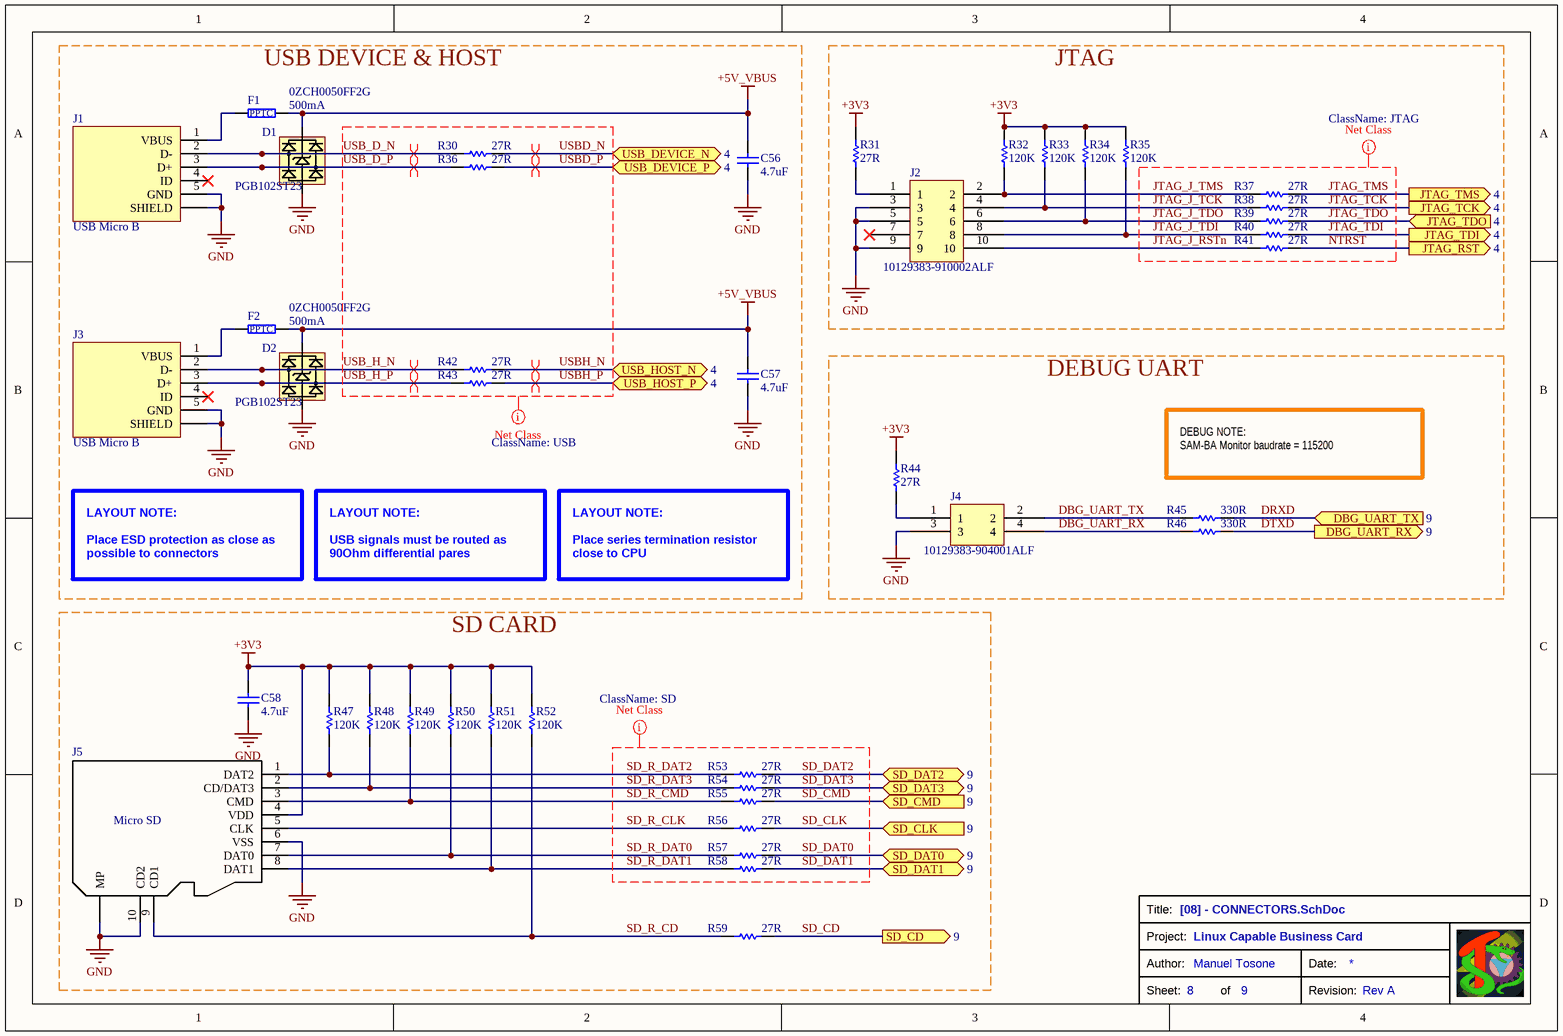
[diagram p7: [08] - CONNECTORS.SchDoc]

### Parts
C56  value 4.7uF  [CAP-0805]  (hidden comment: 885012107013)
C57  value 4.7uF  [CAP-0805]  (hidden comment: 885012107013)
C58  value 4.7uF  [CAP-0805]  (hidden comment: 885012107013)
D1  PGB102ST23  [SOT23-5]
D2  PGB102ST23  [SOT23-5]
F1  0ZCH0050FF2G  value 500mA  [FUS-0ZCH-3x2.35]
F2  0ZCH0050FF2G  value 500mA  [FUS-0ZCH-3x2.35]
J1  USB Micro B  [UJ2-MIBH-G-SMT-TR]
J2  10129383-910002ALF  [HEADER-5X2-2.54-SMD- 10129383]
J3  USB Micro B  [UJ2-MIBH-G-SMT-TR]
J4  10129383-904001ALF  [HEADER-2X2-2.54-SMD- 10129383]
J5  Micro SD  [104031-0811]
R30  value 27R  [RES-0603]  (hidden comment: RT0603DRD0727RL)
R31  value 27R  [RES-0603]  (hidden comment: RT0603DRD0727RL)
R32  value 120K  [RES-0603]  (hidden comment: RT0603FRE07120KL)
R33  value 120K  [RES-0603]  (hidden comment: RT0603FRE07120KL)
R34  value 120K  [RES-0603]  (hidden comment: RT0603FRE07120KL)
R35  value 120K  [RES-0603]  (hidden comment: RT0603FRE07120KL)
R36  value 27R  [RES-0603]  (hidden comment: RT0603DRD0727RL)
R37  value 27R  [RES-0603]  (hidden comment: RT0603DRD0727RL)
R38  value 27R  [RES-0603]  (hidden comment: RT0603DRD0727RL)
R39  value 27R  [RES-0603]  (hidden comment: RT0603DRD0727RL)
R40  value 27R  [RES-0603]  (hidden comment: RT0603DRD0727RL)
R41  value 27R  [RES-0603]  (hidden comment: RT0603DRD0727RL)
R42  value 27R  [RES-0603]  (hidden comment: RT0603DRD0727RL)
R43  value 27R  [RES-0603]  (hidden comment: RT0603DRD0727RL)
R44  value 27R  [RES-0603]  (hidden comment: RT0603DRD0727RL)
R45  value 330R  [RES-0603]  (hidden comment: RT0603FRD07330RL)
R46  value 330R  [RES-0603]  (hidden comment: RT0603FRD07330RL)
R47  value 120K  [RES-0603]  (hidden comment: RT0603FRE07120KL)
R48  value 120K  [RES-0603]  (hidden comment: RT0603FRE07120KL)
R49  value 120K  [RES-0603]  (hidden comment: RT0603FRE07120KL)
R50  value 120K  [RES-0603]  (hidden comment: RT0603FRE07120KL)
R51  value 120K  [RES-0603]  (hidden comment: RT0603FRE07120KL)
R52  value 120K  [RES-0603]  (hidden comment: RT0603FRE07120KL)
R53  value 27R  [RES-0603]  (hidden comment: RT0603DRD0727RL)
R54  value 27R  [RES-0603]  (hidden comment: RT0603DRD0727RL)
R55  value 27R  [RES-0603]  (hidden comment: RT0603DRD0727RL)
R56  value 27R  [RES-0603]  (hidden comment: RT0603DRD0727RL)
R57  value 27R  [RES-0603]  (hidden comment: RT0603DRD0727RL)
R58  value 27R  [RES-0603]  (hidden comment: RT0603DRD0727RL)
R59  value 27R  [RES-0603]  (hidden comment: RT0603DRD0727RL)

### Blocks framed on the sheet
USB DEVICE & HOST: C56 C57 D1 D2 F1 F2 J1 J3 R30 R36 R42 R43
JTAG: J2 R31-R35 R37-R41
DEBUG UART: J4 R44-R46
SD CARD: C58 J5 R47-R59

### Ports
DBG_UART_RX (out, see 9), DBG_UART_TX (in, see 9), JTAG_RST (out, see 4), JTAG_TCK (out, see 4), JTAG_TDI (out, see 4), JTAG_TDO (in, see 4), JTAG_TMS (out, see 4), SD_CD (out, see 9), SD_CLK (in, see 9), SD_CMD (in, see 9), SD_DAT0 (bidir, see 9), SD_DAT1 (bidir, see 9), SD_DAT2 (bidir, see 9), SD_DAT3 (bidir, see 9), USB_DEVICE_N (bidir, see 4), USB_DEVICE_P (bidir, see 4), USB_HOST_N (bidir, see 4), USB_HOST_P (bidir, see 4)

### Nets
+3V3: C58.2 J5.4(VDD) R31.2 R32.2 R33.2 R34.2 R35.2 R44.2 R47.2 R48.2 R49.2 R50.2 R51.2 R52.2
+5V_VBUS: C56.2 C57.2 D1.5(Vp) D2.5(Vp) F1.2 F2.2
GND: C56.1 C57.1 C58.1 D1.2(Vn) D2.2(Vn) J1.5(GND) J1.SH(SHIELD) J2.3 J2.5 J2.9 J3.5(GND) J3.SH(SHIELD) J4.3 J5.6(VSS) J5.10(CD2) J5.MP
DBG_UART_RX: J4.4 R46.1
DBG_UART_TX: J4.2 R45.1
DRXD: R45.2 ; port DBG_UART_TX
DTXD: R46.2 ; port DBG_UART_RX
JTAG_J_RSTn: J2.10 R41.1
JTAG_J_TCK: J2.4 R33.1 R38.1
JTAG_J_TDI: J2.8 R35.1 R40.1
JTAG_J_TDO: J2.6 R34.1 R39.1
JTAG_J_TMS: J2.2 R32.1 R37.1
JTAG_TCK: R38.2 ; port JTAG_TCK
JTAG_TDI: R40.2 ; port JTAG_TDI
JTAG_TDO: R39.2 ; port JTAG_TDO
JTAG_TMS: R37.2 ; port JTAG_TMS
NTRST: R41.2 ; port JTAG_RST
SD_CD: R59.2 ; port SD_CD
SD_CLK: R56.2 ; port SD_CLK
SD_CMD: R55.2 ; port SD_CMD
SD_DAT0: R57.2 ; port SD_DAT0
SD_DAT1: R58.2 ; port SD_DAT1
SD_DAT2: R53.2 ; port SD_DAT2
SD_DAT3: R54.2 ; port SD_DAT3
SD_R_CD: J5.9(CD1) R52.1 R59.1
SD_R_CLK: J5.5(CLK) R56.1
SD_R_CMD: J5.3(CMD) R49.1 R55.1
SD_R_DAT0: J5.7(DAT0) R50.1 R57.1
SD_R_DAT1: J5.8(DAT1) R51.1 R58.1
SD_R_DAT2: J5.1(DAT2) R47.1 R53.1
SD_R_DAT3: J5.2(CD/DAT3) R48.1 R54.1
USB_D_N: D1.3(CH1) J1.2(D-) R30.1
USB_D_P: D1.4(CH2) J1.3(D+) R36.1
USB_H_N: D2.3(CH1) J3.2(D-) R42.1
USB_H_P: D2.4(CH2) J3.3(D+) R43.1
USBD_N: R30.2 ; port USB_DEVICE_N
USBD_P: R36.2 ; port USB_DEVICE_P
USBH_N: R42.2 ; port USB_HOST_N
USBH_P: R43.2 ; port USB_HOST_P
NetF1_1: F1.1 J1.1(VBUS)
NetF2_1: F2.1 J3.1(VBUS)
NetJ2_1: J2.1 R31.1
NetJ4_1: J4.1 R44.1

Not connected (* = marked no-connect by the designer): J1 4(ID)*; J2 7*; J3 4(ID)*

### Layout directives
differential pair; differential pair class DIFF90: USB_D_N, USB_D_P, USB_H_N, USB_H_P, USBD_N, USBD_P, USBH_N, USBH_P
net class SD: SD_CLK, SD_CMD, SD_DAT0, SD_DAT1, SD_DAT2, SD_DAT3, SD_R_CLK, SD_R_CMD, SD_R_DAT0, SD_R_DAT1, SD_R_DAT2, SD_R_DAT3
net class USB: USB_D_N, USB_D_P, USB_H_N, USB_H_P, USBD_N, USBD_P, USBH_N, USBH_P
net class JTAG: JTAG_J_RSTn, JTAG_J_TCK, JTAG_J_TDI, JTAG_J_TDO, JTAG_J_TMS, JTAG_TCK, JTAG_TDI, JTAG_TDO, JTAG_TMS, NTRST

### Notes on the sheet
- DEBUG NOTE:
  SAM-BA Monitor baudrate = 115200
- LAYOUT NOTE:
  Place ESD protection as close as possible to connectors
- LAYOUT NOTE:
  USB signals must be routed as 90Ohm differential pares
- LAYOUT NOTE:
  Place series termination resistor close to CPU
- Title:
- Project:
- Sheet:
- Author:
- of
- Revision:
- Date:
- (in symbol PPTC-500mA-16V-0ZCH0050FF2G) PPTC

### Library data of the parts
C56-C58 = CAP-0805-4.7u-885012107013_2: as C1 on sheet [03] - POWER SUPPLIES; Supplier 1: Mouser; Supplier Part Number 1: 710-885012107013
D1 D2 = DIODE-TVS-PGB102ST23: ESD Suppressors / TVS Diodes 2 Ch TVS Diode Array 3.3V 6.0A 400mW; Supplier 1: Mouser; Supplier Part Number 1: 621-D1213A-02SM-7
F1 F2 = PPTC-500mA-16V-0ZCH0050FF2G: Resettable Fuses - PPTC Fuse; Manufacturer: Bel; Maximum Voltage: 16V; Supplier 1: Mouser; Supplier Part Number 1: 530-0ZCH0050FF2G
J1 J3 = UJ2-MIBH-G-SMT-TR: USB Connectors Micro B, USB 2.0, 1.8 A, Right Angle, Surface Mount (SMT), USB Receptacle; Supplier 1: Mouser; Supplier Part Number 1: 490-UJ2-MIBH-G-SMTTR
J2 = HEADER-5x2-2.54-SMD-10129383-910002ALF: Headers & Wire Housings ECONOSTIK HEADER DR VT SMT 2X5; Supplier 1: Mouser; Supplier Part Number 1: 649-1012938391002ALF
J4 = HEADER-2x2-2.54-SMD-10129383-904001ALF: Headers & Wire Housings ECONOSTIK HEADER DR VT SMT 2X2; Supplier 1: Mouser; Supplier Part Number 1: 649-1012938390401ALF
J5 = 104031-0811: Memory Card Connectors MICRO SD PUSH-PULL SMT 1.42MM HEIGHT; Supplier 1: Mouser; Supplier Part Number 1: 538-104031-0811
R30 R31 R36-R44 R53-R59 = RES-0603-27R-RT0603DRD0727RL: as R21 on sheet [06] - RAM DDR2; Supplier 1: Mouser; Supplier Part Number 1: 603-RT0603DRD0727RL
R32-R35 R47-R52 = RES-0603-120K-RT0603FRE07120KL: as R2 on sheet [03] - POWER SUPPLIES; Supplier 1: Mouser; Supplier Part Number 1: 603-RT0603FRE07120KL
R45 R46 = RES-0603-330R-RT0603FRD07330RL: as R10 on sheet [04] - CPU POWER; Supplier 1: Mouser; Supplier Part Number 1: 603-RT0603FRD07330RL

## Sheet [09] - CPU GPIO.SchDoc
size A4; DocumentNumber: 9; SheetNumber: 9; SheetTotal: 9
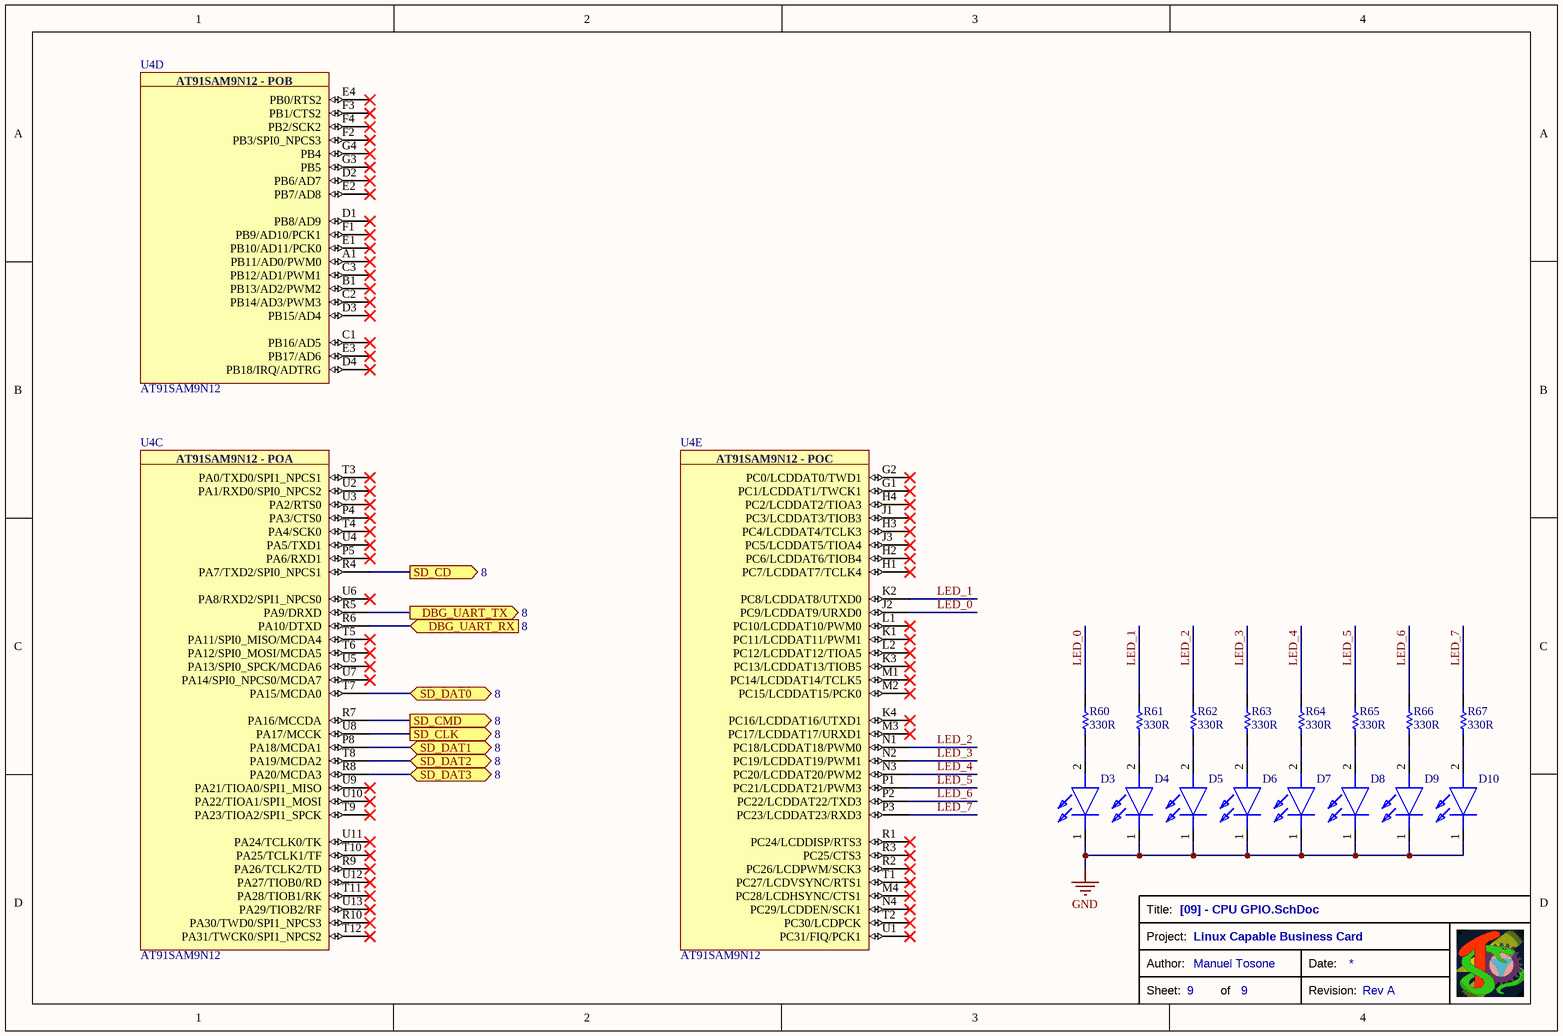
[diagram p8: [09] - CPU GPIO.SchDoc]

### Parts
D3  150060VS75000  [LED-SMD-0603-1.6X0.8]  (value not drawn)
D4  150060VS75000  [LED-SMD-0603-1.6X0.8]  (value not drawn)
D5  150060VS75000  [LED-SMD-0603-1.6X0.8]  (value not drawn)
D6  150060VS75000  [LED-SMD-0603-1.6X0.8]  (value not drawn)
D7  150060VS75000  [LED-SMD-0603-1.6X0.8]  (value not drawn)
D8  150060VS75000  [LED-SMD-0603-1.6X0.8]  (value not drawn)
D9  150060VS75000  [LED-SMD-0603-1.6X0.8]  (value not drawn)
D10  150060VS75000  [LED-SMD-0603-1.6X0.8]  (value not drawn)
R60  value 330R  [RES-0603]  (hidden comment: RT0603FRD07330RL)
R61  value 330R  [RES-0603]  (hidden comment: RT0603FRD07330RL)
R62  value 330R  [RES-0603]  (hidden comment: RT0603FRD07330RL)
R63  value 330R  [RES-0603]  (hidden comment: RT0603FRD07330RL)
R64  value 330R  [RES-0603]  (hidden comment: RT0603FRD07330RL)
R65  value 330R  [RES-0603]  (hidden comment: RT0603FRD07330RL)
R66  value 330R  [RES-0603]  (hidden comment: RT0603FRD07330RL)
R67  value 330R  [RES-0603]  (hidden comment: RT0603FRD07330RL)
U4  AT91SAM9N12  [BGA0.8P17X17_217_15X15]  (parts C,D,E of 6)

### Ports
DBG_UART_RX (in, see 8), DBG_UART_TX (out, see 8), SD_CD (out, see 8), SD_CLK (out, see 8), SD_CMD (out, see 8), SD_DAT0 (bidir, see 8), SD_DAT1 (bidir, see 8), SD_DAT2 (bidir, see 8), SD_DAT3 (bidir, see 8)

### Nets
GND: D3.1(K) D4.1(K) D5.1(K) D6.1(K) D7.1(K) D8.1(K) D9.1(K) D10.1(K)
DRXD: U4.R5(PA9/DRXD) ; port DBG_UART_TX
DTXD: U4.R6(PA10/DTXD) ; port DBG_UART_RX
LED_0: R60.2 U4.J2(PC9/LCDDAT9/URXD0)
LED_1: R61.2 U4.K2(PC8/LCDDAT8/UTXD0)
LED_2: R62.2 U4.N1(PC18/LCDDAT18/PWM0)
LED_3: R63.2 U4.N2(PC19/LCDDAT19/PWM1)
LED_4: R64.2 U4.N3(PC20/LCDDAT20/PWM2)
LED_5: R65.2 U4.P1(PC21/LCDDAT21/PWM3)
LED_6: R66.2 U4.P2(PC22/LCDDAT22/TXD3)
LED_7: R67.2 U4.P3(PC23/LCDDAT23/RXD3)
SD_CD: U4.R4(PA7/TXD2/SPI0_NPCS1) ; port SD_CD
SD_CLK: U4.U8(PA17/MCCK) ; port SD_CLK
SD_CMD: U4.R7(PA16/MCCDA) ; port SD_CMD
SD_DAT0: U4.T7(PA15/MCDA0) ; port SD_DAT0
SD_DAT1: U4.P8(PA18/MCDA1) ; port SD_DAT1
SD_DAT2: U4.T8(PA19/MCDA2) ; port SD_DAT2
SD_DAT3: U4.R8(PA20/MCDA3) ; port SD_DAT3
NetD3_2: D3.2(A) R60.1
NetD4_2: D4.2(A) R61.1
NetD5_2: D5.2(A) R62.1
NetD6_2: D6.2(A) R63.1
NetD7_2: D7.2(A) R64.1
NetD8_2: D8.2(A) R65.1
NetD9_2: D9.2(A) R66.1
NetD10_2: D10.2(A) R67.1

Not connected (* = marked no-connect by the designer): U4 A1(PB11/AD0/PWM0)* B1(PB13/AD2/PWM2)* C1(PB16/AD5)* C2(PB14/AD3/PWM3)* C3(PB12/AD1/PWM1)* D1(PB8/AD9)* D2(PB6/AD7)* D3(PB15/AD4)* D4(PB18/IRQ/ADTRG)* E1(PB10/AD11/PCK0)* E2(PB7/AD8)* E3(PB17/AD6)* E4(PB0/RTS2)* F1(PB9/AD10/PCK1)* F2(PB3/SPI0_NPCS3)* F3(PB1/CTS2)* F4(PB2/SCK2)* G1(PC1/LCDDAT1/TWCK1)* G2(PC0/LCDDAT0/TWD1)* G3(PB5)* G4(PB4)* H1(PC7/LCDDAT7/TCLK4)* H2(PC6/LCDDAT6/TIOB4)* H3(PC4/LCDDAT4/TCLK3)* H4(PC2/LCDDAT2/TIOA3)* J1(PC3/LCDDAT3/TIOB3)* J3(PC5/LCDDAT5/TIOA4)* K1(PC11/LCDDAT11/PWM1)* K3(PC13/LCDDAT13/TIOB5)* K4(PC16/LCDDAT16/UTXD1)* L1(PC10/LCDDAT10/PWM0)* L2(PC12/LCDDAT12/TIOA5)* M1(PC14/LCDDAT14/TCLK5)* M2(PC15/LCDDAT15/PCK0)* M3(PC17/LCDDAT17/URXD1)* M4(PC28/LCDHSYNC/CTS1)* N4(PC29/LCDDEN/SCK1)* P4(PA3/CTS0)* P5(PA6/RXD1)* R1(PC24/LCDDISP/RTS3)* R2(PC26/LCDPWM/SCK3)* R3(PC25/CTS3)* R9(PA26/TCLK2/TD)* R10(PA30/TWD0/SPI1_NPCS3)* T1(PC27/LCDVSYNC/RTS1)* T2(PC30/LCDPCK)* T3(PA0/TXD0/SPI1_NPCS1)* T4(PA4/SCK0)* T5(PA11/SPI0_MISO/MCDA4)* T6(PA12/SPI0_MOSI/MCDA5)* T9(PA23/TIOA2/SPI1_SPCK)* T10(PA25/TCLK1/TF)* T11(PA28/TIOB1/RK)* T12(PA31/TWCK0/SPI1_NPCS2)* U1(PC31/FIQ/PCK1)* U2(PA1/RXD0/SPI0_NPCS2)* U3(PA2/RTS0)* U4(PA5/TXD1)* U5(PA13/SPI0_SPCK/MCDA6)* U6(PA8/RXD2/SPI1_NPCS0)* U7(PA14/SPI0_NPCS0/MCDA7)* U9(PA21/TIOA0/SPI1_MISO)* U10(PA22/TIOA1/SPI1_MOSI)* U11(PA24/TCLK0/TK)* U12(PA27/TIOB0/RD)* U13(PA29/TIOB2/RF)*

### Notes on the sheet
- Title:
- Project:
- Sheet:
- Author:
- of
- Revision:
- Date:
- (in symbol AT91SAM9N12, part C) AT91SAM9N12 - POA
- (in symbol AT91SAM9N12, part D) AT91SAM9N12 - POB
- (in symbol AT91SAM9N12, part E) AT91SAM9N12 - POC

### Library data of the parts
D3-D10 = LED-SMD-0603-Green-150060VS75000: Standard LEDs - SMD WL-SMCW SMDMono TpVw Waterclr 0603 BrtGrn; Value: Green; Supplier 1: Mouser; Supplier Part Number 1: 710-150060VS75000
R60-R67 = RES-0603-330R-RT0603FRD07330RL: as R10 on sheet [04] - CPU POWER; Supplier 1: Mouser; Supplier Part Number 1: 603-RT0603FRD07330RL
U4 = AT91SAM9N12: MPU ARM926EJ-S 400MHz; Supplier 1: Mouser; Supplier Part Number 1: 556-AT91SAM9N12-CU

## Nets that join several sheets
+1V0: [03] - POWER SUPPLIES (C14.2 R6.2 TP3.1 U3.8), [04] - CPU POWER (11 pins)
+1V8: [03] - POWER SUPPLIES (C11.2 R1.2 TP2.1 U2.8), [04] - CPU POWER (7 pins), [06] - RAM DDR2 (28 pins)
+3V3: [03] - POWER SUPPLIES (16 pins), [04] - CPU POWER (26 pins), [07] - NAND FLASH (12 pins), [08] - CONNECTORS (14 pins)
+5V_VBUS: [03] - POWER SUPPLIES (5 pins), [08] - CONNECTORS (6 pins)
GND: [03] - POWER SUPPLIES (22 pins), [04] - CPU POWER (47 pins), [06] - RAM DDR2 (31 pins), [07] - NAND FLASH (10 pins), [08] - CONNECTORS (16 pins), [09] - CPU GPIO (8 pins)
1V0_PG: [03] - POWER SUPPLIES (R9.1 U3.5), [04] - CPU POWER (R12.1)
DRAM_A0: [05] - CPU EBI INTERFACE (U4.F16), [06] - RAM DDR2 (U5.M8)
DRAM_A1: [05] - CPU EBI INTERFACE (U4.B17), [06] - RAM DDR2 (U5.M3)
DRAM_A2: [05] - CPU EBI INTERFACE (U4.A17), [06] - RAM DDR2 (U5.M7)
DRAM_A3: [05] - CPU EBI INTERFACE (U4.F15), [06] - RAM DDR2 (U5.N2)
DRAM_A4: [05] - CPU EBI INTERFACE (U4.E16), [06] - RAM DDR2 (U5.N8)
DRAM_A5: [05] - CPU EBI INTERFACE (U4.D16), [06] - RAM DDR2 (U5.N3)
DRAM_A6: [05] - CPU EBI INTERFACE (U4.E15), [06] - RAM DDR2 (U5.N7)
DRAM_A7: [05] - CPU EBI INTERFACE (U4.G14), [06] - RAM DDR2 (U5.P2)
DRAM_A8: [05] - CPU EBI INTERFACE (U4.C16), [06] - RAM DDR2 (U5.P8)
DRAM_A9: [05] - CPU EBI INTERFACE (U4.F14), [06] - RAM DDR2 (U5.P3)
DRAM_A10: [05] - CPU EBI INTERFACE (U4.B6), [06] - RAM DDR2 (U5.M2)
DRAM_A11: [05] - CPU EBI INTERFACE (U4.A16), [06] - RAM DDR2 (U5.P7)
DRAM_A12: [05] - CPU EBI INTERFACE (U4.C15), [06] - RAM DDR2 (U5.R2)
DRAM_A13: [05] - CPU EBI INTERFACE (U4.D15), [06] - RAM DDR2 (U5.R8)
DRAM_BA0: [05] - CPU EBI INTERFACE (U4.B15), [06] - RAM DDR2 (U5.L2)
DRAM_BA1: [05] - CPU EBI INTERFACE (U4.E14), [06] - RAM DDR2 (U5.L3)
DRAM_BA2: [05] - CPU EBI INTERFACE (U4.A15), [06] - RAM DDR2 (U5.L1)
DRAM_CAS: [05] - CPU EBI INTERFACE (U4.D9), [06] - RAM DDR2 (U5.L7)
DRAM_CKE: [05] - CPU EBI INTERFACE (U4.D10), [06] - RAM DDR2 (U5.K2)
DRAM_CLK_N: [05] - CPU EBI INTERFACE (U4.A9), [06] - RAM DDR2 (R22.1)
DRAM_CLK_P: [05] - CPU EBI INTERFACE (U4.A10), [06] - RAM DDR2 (R21.1)
DRAM_CS: [05] - CPU EBI INTERFACE (U4.C5), [06] - RAM DDR2 (U5.L8)
DRAM_D0: [05] - CPU EBI INTERFACE (U4.C14), [06] - RAM DDR2 (U5.G8)
DRAM_D1: [05] - CPU EBI INTERFACE (U4.B13), [06] - RAM DDR2 (U5.G2)
DRAM_D2: [05] - CPU EBI INTERFACE (U4.A14), [06] - RAM DDR2 (U5.H7)
DRAM_D3: [05] - CPU EBI INTERFACE (U4.A13), [06] - RAM DDR2 (U5.H3)
DRAM_D4: [05] - CPU EBI INTERFACE (U4.C13), [06] - RAM DDR2 (U5.H1)
DRAM_D5: [05] - CPU EBI INTERFACE (U4.B14), [06] - RAM DDR2 (U5.H9)
DRAM_D6: [05] - CPU EBI INTERFACE (U4.C12), [06] - RAM DDR2 (U5.F1)
DRAM_D7: [05] - CPU EBI INTERFACE (U4.D13), [06] - RAM DDR2 (U5.F9)
DRAM_D8: [05] - CPU EBI INTERFACE (U4.C10), [06] - RAM DDR2 (U5.C8)
DRAM_D9: [05] - CPU EBI INTERFACE (U4.A11), [06] - RAM DDR2 (U5.C2)
DRAM_D10: [05] - CPU EBI INTERFACE (U4.C11), [06] - RAM DDR2 (U5.D7)
DRAM_D11: [05] - CPU EBI INTERFACE (U4.A12), [06] - RAM DDR2 (U5.D3)
DRAM_D12: [05] - CPU EBI INTERFACE (U4.B12), [06] - RAM DDR2 (U5.D1)
DRAM_D13: [05] - CPU EBI INTERFACE (U4.D12), [06] - RAM DDR2 (U5.D9)
DRAM_D14: [05] - CPU EBI INTERFACE (U4.B11), [06] - RAM DDR2 (U5.B1)
DRAM_D15: [05] - CPU EBI INTERFACE (U4.D11), [06] - RAM DDR2 (U5.B9)
DRAM_LDM: [05] - CPU EBI INTERFACE (U4.C9), [06] - RAM DDR2 (U5.F3)
DRAM_LDQSp: [05] - CPU EBI INTERFACE (U4.B8), [06] - RAM DDR2 (U5.F7)
DRAM_RAS: [05] - CPU EBI INTERFACE (U4.B9), [06] - RAM DDR2 (U5.K7)
DRAM_UDM: [05] - CPU EBI INTERFACE (U4.A8), [06] - RAM DDR2 (U5.B3)
DRAM_UDQSp: [05] - CPU EBI INTERFACE (U4.A7), [06] - RAM DDR2 (U5.B7)
DRAM_WE: [05] - CPU EBI INTERFACE (U4.B10), [06] - RAM DDR2 (U5.K3)
DRXD: [08] - CONNECTORS (R45.2), [09] - CPU GPIO (U4.R5)
DTXD: [08] - CONNECTORS (R46.2), [09] - CPU GPIO (U4.R6)
FLASH_ALE: [05] - CPU EBI INTERFACE (U4.M15), [07] - NAND FLASH (U6.C4)
FLASH_CLE: [05] - CPU EBI INTERFACE (U4.M14), [07] - NAND FLASH (U6.D5)
FLASH_CS: [05] - CPU EBI INTERFACE (U4.P16), [07] - NAND FLASH (R25.1 U6.C6)
FLASH_D0: [05] - CPU EBI INTERFACE (U4.L15), [07] - NAND FLASH (U6.H4)
FLASH_D1: [05] - CPU EBI INTERFACE (U4.L16), [07] - NAND FLASH (U6.J4)
FLASH_D2: [05] - CPU EBI INTERFACE (U4.L17), [07] - NAND FLASH (U6.K4)
FLASH_D3: [05] - CPU EBI INTERFACE (U4.K17), [07] - NAND FLASH (U6.K5)
FLASH_D4: [05] - CPU EBI INTERFACE (U4.K16), [07] - NAND FLASH (U6.K6)
FLASH_D5: [05] - CPU EBI INTERFACE (U4.K15), [07] - NAND FLASH (U6.J7)
FLASH_D6: [05] - CPU EBI INTERFACE (U4.J17), [07] - NAND FLASH (U6.K7)
FLASH_D7: [05] - CPU EBI INTERFACE (U4.J16), [07] - NAND FLASH (U6.J8)
FLASH_OE: [05] - CPU EBI INTERFACE (U4.P15), [07] - NAND FLASH (U6.D4)
FLASH_RDY: [05] - CPU EBI INTERFACE (U4.M17), [07] - NAND FLASH (R26.1 R28.1)
FLASH_WE: [05] - CPU EBI INTERFACE (U4.N14), [07] - NAND FLASH (U6.C7)
JTAG_TCK: [04] - CPU POWER (U4.R12), [08] - CONNECTORS (R38.2)
JTAG_TDI: [04] - CPU POWER (U4.R11), [08] - CONNECTORS (R40.2)
JTAG_TDO: [04] - CPU POWER (U4.U14), [08] - CONNECTORS (R39.2)
JTAG_TMS: [04] - CPU POWER (U4.T13), [08] - CONNECTORS (R37.2)
NTRST: [04] - CPU POWER (U4.T15), [08] - CONNECTORS (R41.2)
SD_CD: [08] - CONNECTORS (R59.2), [09] - CPU GPIO (U4.R4)
SD_CLK: [08] - CONNECTORS (R56.2), [09] - CPU GPIO (U4.U8)
SD_CMD: [08] - CONNECTORS (R55.2), [09] - CPU GPIO (U4.R7)
SD_DAT0: [08] - CONNECTORS (R57.2), [09] - CPU GPIO (U4.T7)
SD_DAT1: [08] - CONNECTORS (R58.2), [09] - CPU GPIO (U4.P8)
SD_DAT2: [08] - CONNECTORS (R53.2), [09] - CPU GPIO (U4.T8)
SD_DAT3: [08] - CONNECTORS (R54.2), [09] - CPU GPIO (U4.R8)
USBD_N: [04] - CPU POWER (U4.R16), [08] - CONNECTORS (R30.2)
USBD_P: [04] - CPU POWER (U4.R17), [08] - CONNECTORS (R36.2)
USBH_N: [04] - CPU POWER (U4.N17), [08] - CONNECTORS (R42.2)
USBH_P: [04] - CPU POWER (U4.P17), [08] - CONNECTORS (R43.2)